# EAGLE schematic synth_revC (EAGLE 6.6.0)

## Sheet 1 of 4
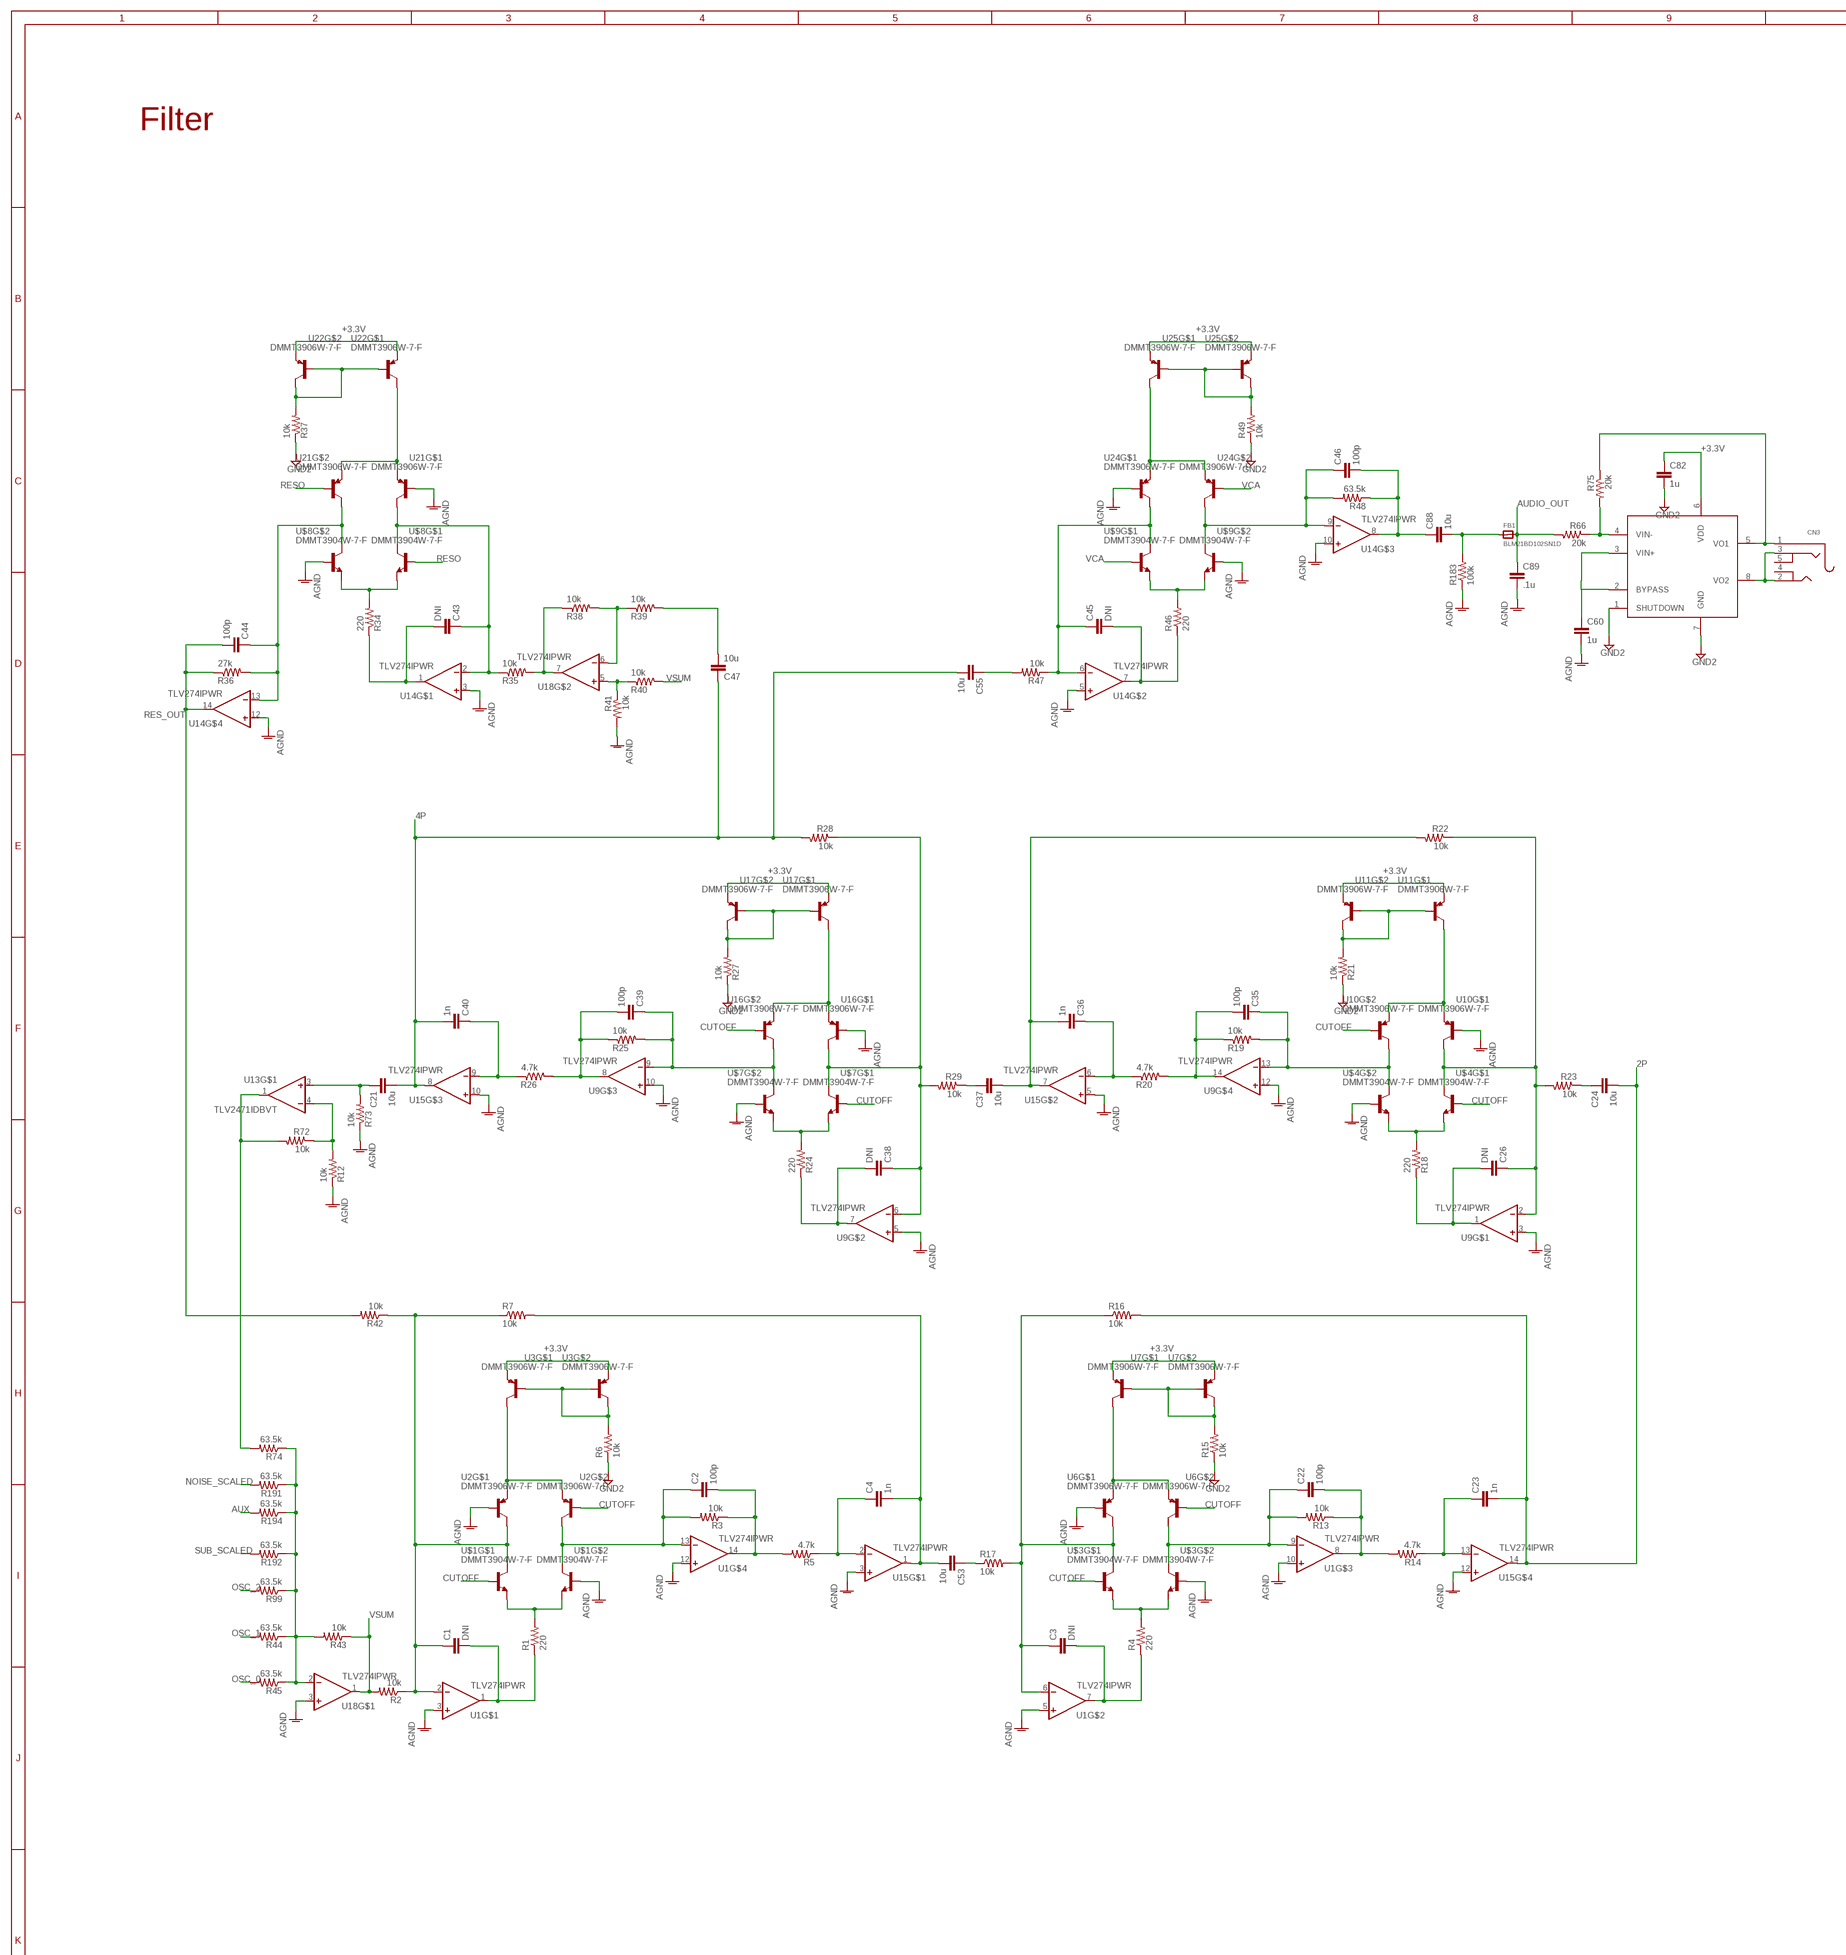
[diagram p0: schematic, sheet 1, part 1 of 3]
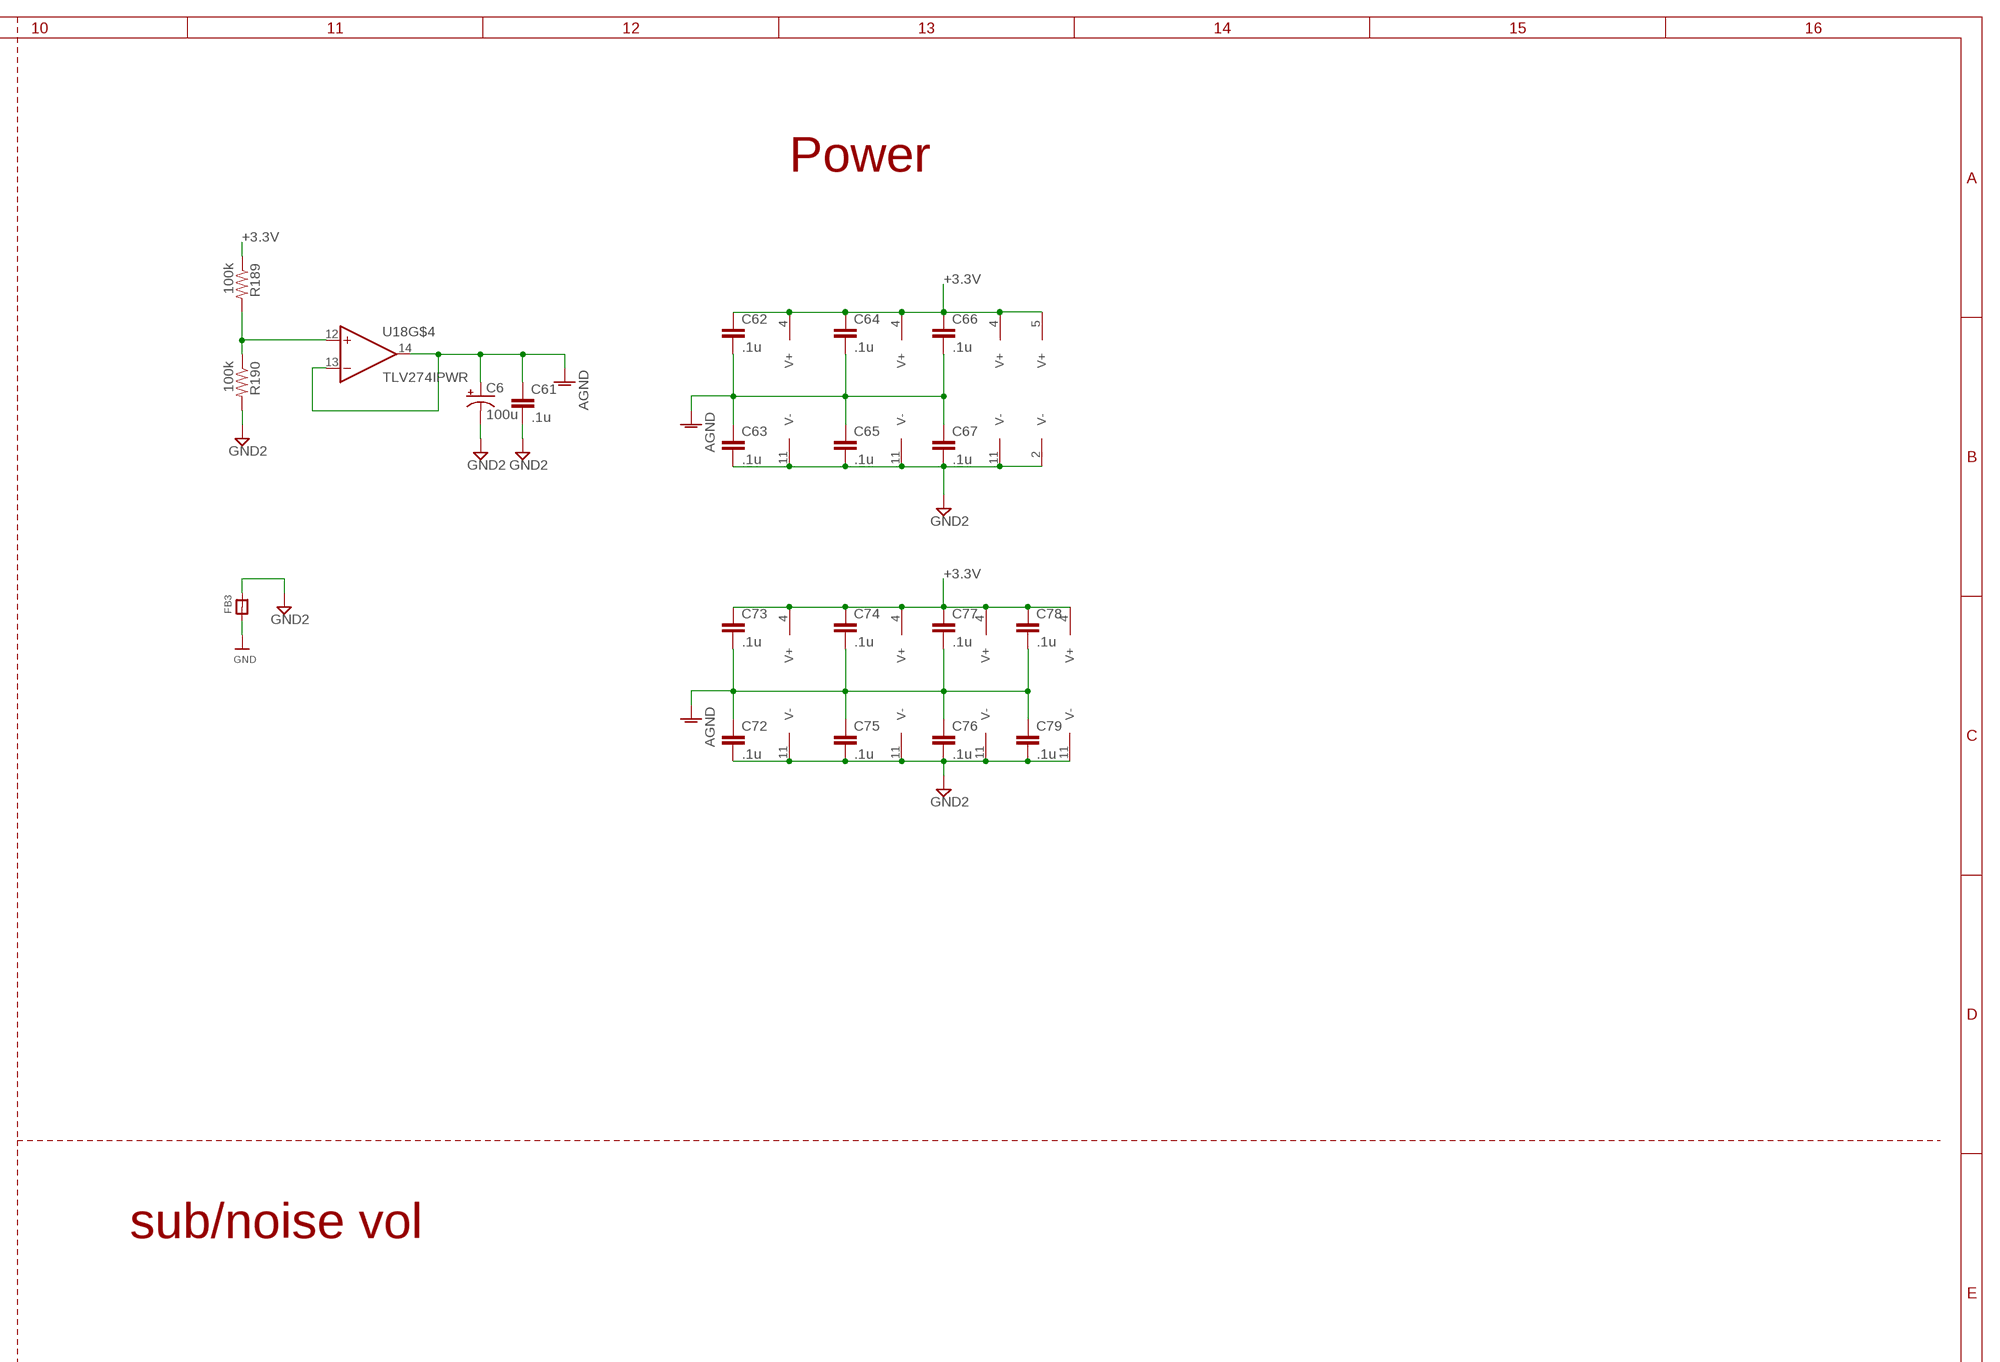
[diagram p1: schematic, sheet 1, part 2 of 3]
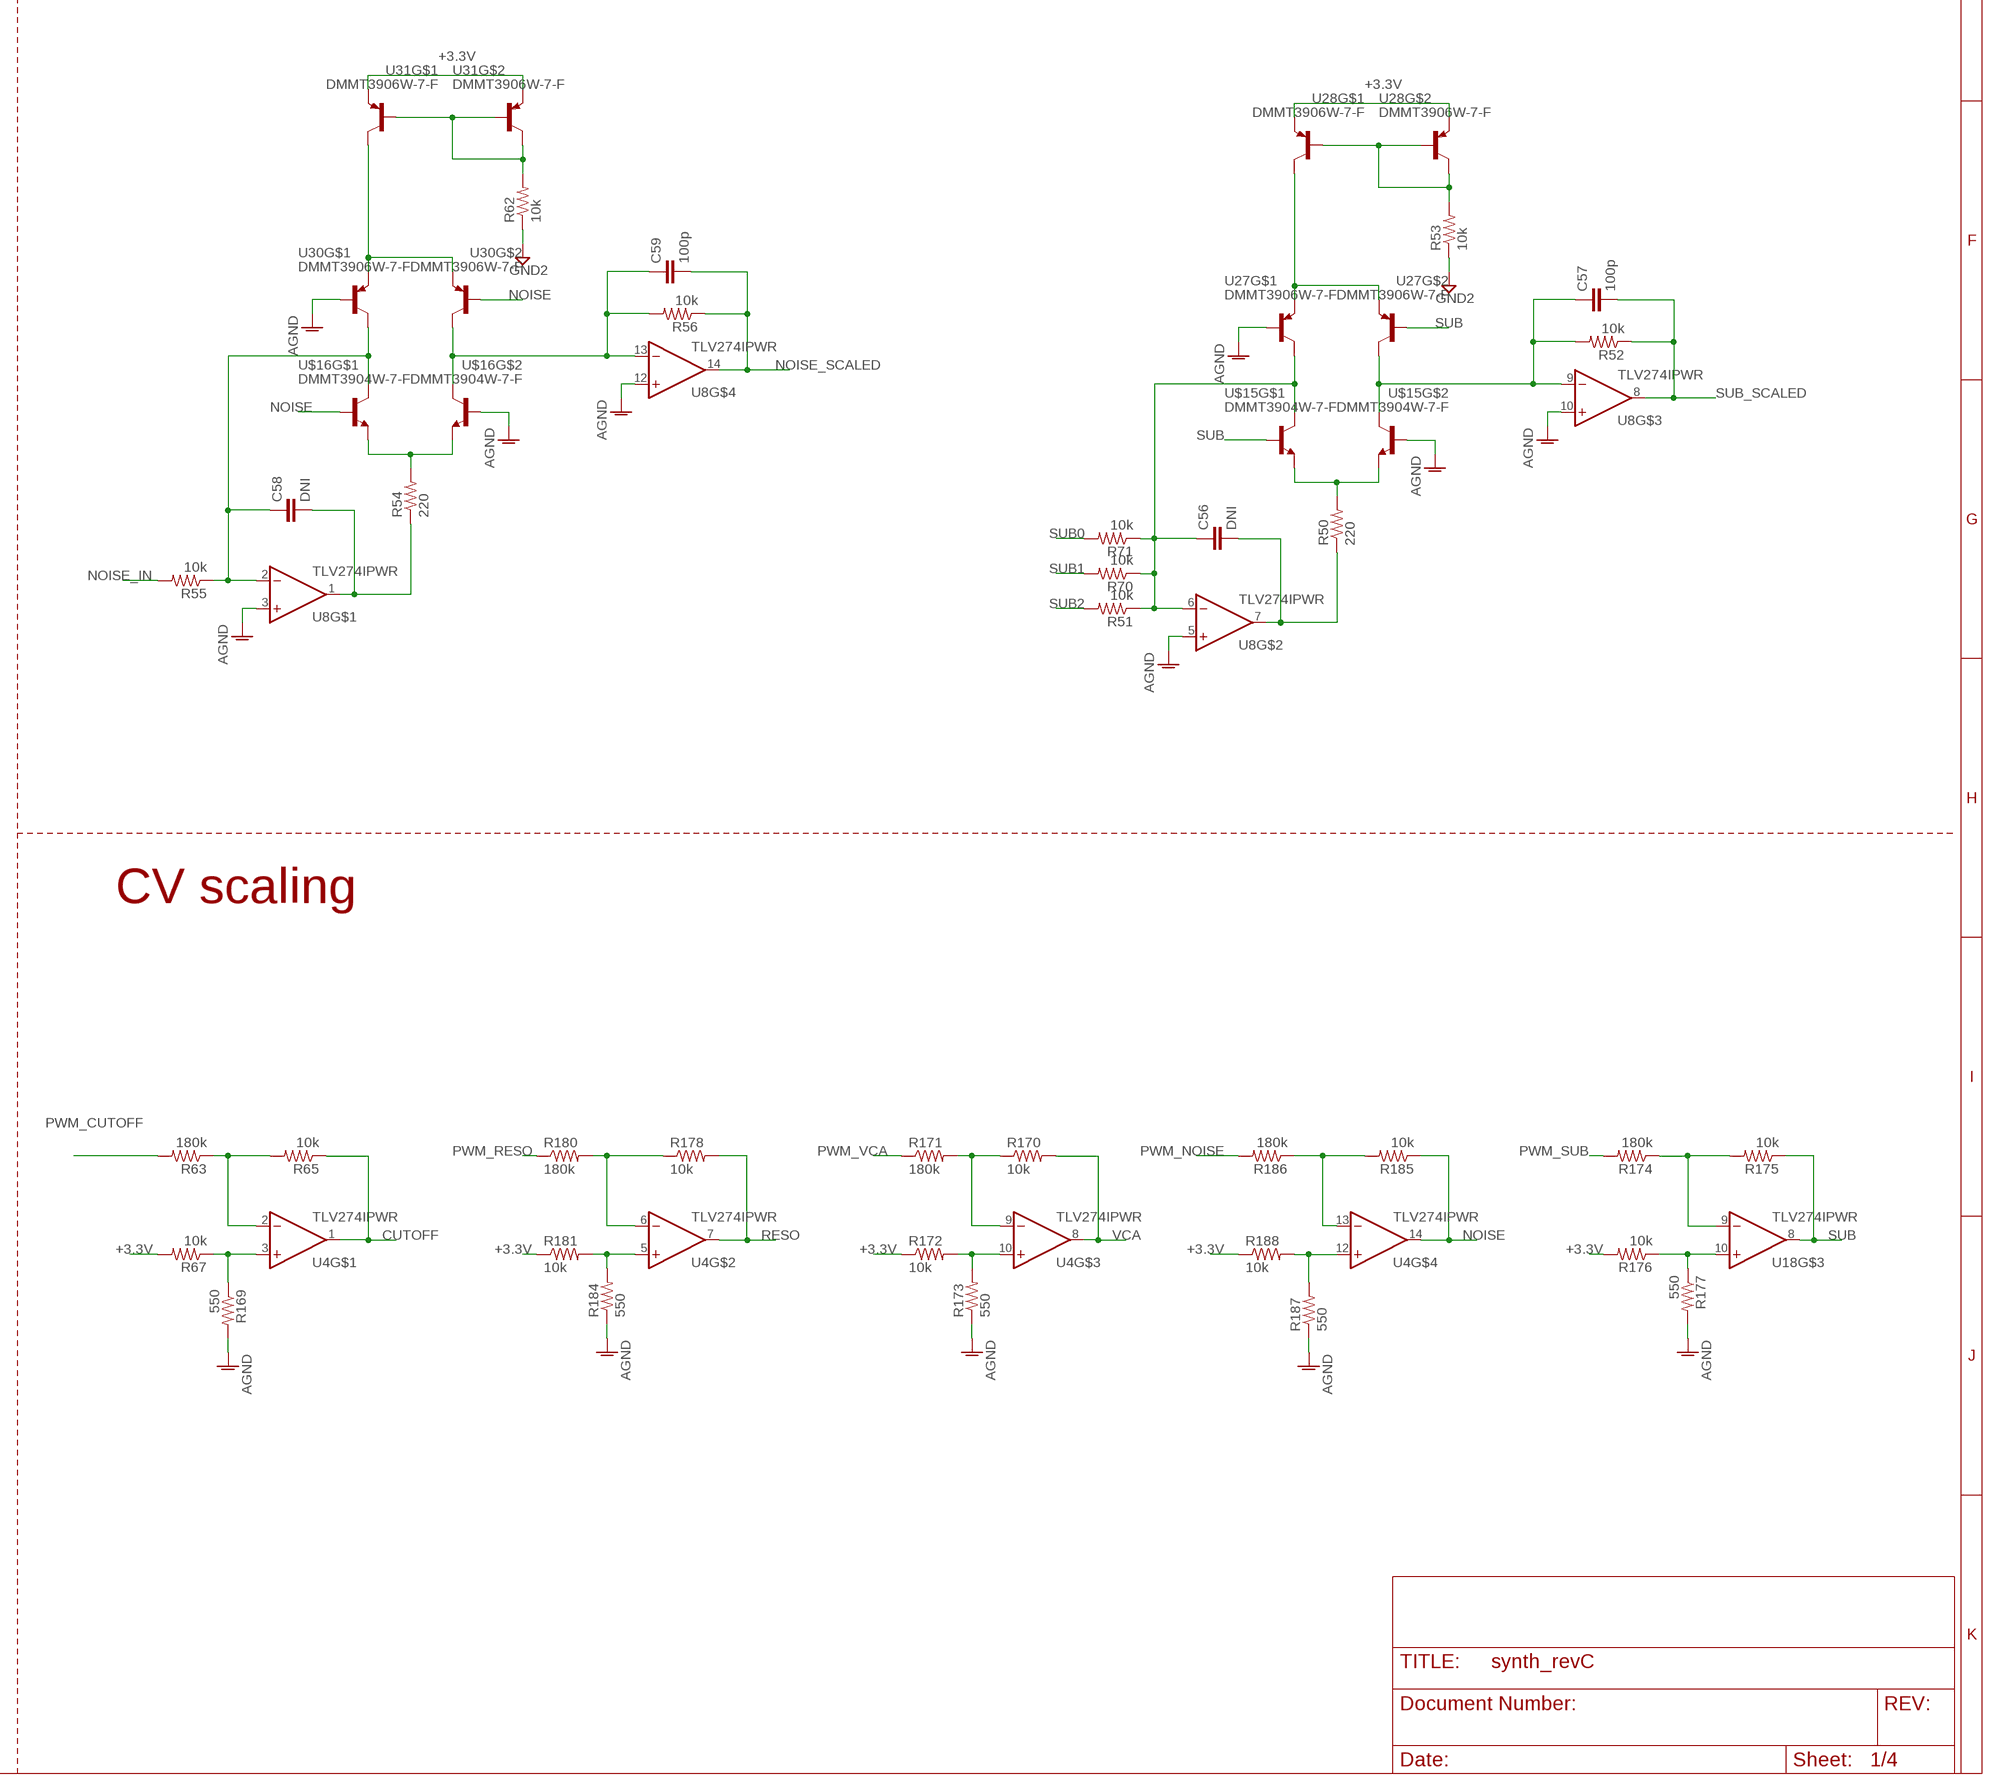
[diagram p2: schematic, sheet 1, part 3 of 3]

### Parts
C1  DNI  C-EUC0603  [C0603]
C2  100p  C-EUC0603  [C0603]
C3  DNI  C-EUC0603  [C0603]
C4  1n  C-EUC0603  [C0603]
C6  100u  CPOL-USC  [PANASONIC_C]
C21  10u  C-EUC0603  [C0603]
C22  100p  C-EUC0603  [C0603]
C23  1n  C-EUC0603  [C0603]
C24  10u  C-EUC0603  [C0603]
C26  DNI  C-EUC0603  [C0603]
C35  100p  C-EUC0603  [C0603]
C36  1n  C-EUC0603  [C0603]
C37  10u  C-EUC0603  [C0603]
C38  DNI  C-EUC0603  [C0603]
C39  100p  C-EUC0603  [C0603]
C40  1n  C-EUC0603  [C0603]
C43  DNI  C-EUC0603  [C0603]
C44  100p  C-EUC0603  [C0603]
C45  DNI  C-EUC0603  [C0603]
C46  100p  C-EUC0603  [C0603]
C47  10u  C-EUC0603  [C0603]
C53  10u  C-EUC0603  [C0603]
C55  10u  C-EUC0603  [C0603]
C56  DNI  C-EUC0603  [C0603]
C57  100p  C-EUC0603  [C0603]
C58  DNI  C-EUC0603  [C0603]
C59  100p  C-EUC0603  [C0603]
C60  1u  C-EUC0603  [C0603]
C61  .1u  C-EUC0603  [C0603]
C62  .1u  C-EUC0603  [C0603]
C63  .1u  C-EUC0603  [C0603]
C64  .1u  C-EUC0603  [C0603]
C65  .1u  C-EUC0603  [C0603]
C66  .1u  C-EUC0603  [C0603]
C67  .1u  C-EUC0603  [C0603]
C72  .1u  C-EUC0603  [C0603]
C73  .1u  C-EUC0603  [C0603]
C74  .1u  C-EUC0603  [C0603]
C75  .1u  C-EUC0603  [C0603]
C76  .1u  C-EUC0603  [C0603]
C77  .1u  C-EUC0603  [C0603]
C78  .1u  C-EUC0603  [C0603]
C79  .1u  C-EUC0603  [C0603]
C82  1u  C-EUC0603  [C0603]
C88  10u  C-EUC0603  [C0603]
C89  .1u  C-EUC0603  [C0603]
CN3  AUDIO_3.5MMJACK  [4UCONN_19269]
FB1  BLM21BD102SN1D  FERRITE0805  [0805]
FB3  FERRITE0805  [0805]
R1  220  R-US_R0603  [R0603]
R2  10k  R-US_R0603  [R0603]
R3  10k  R-US_R0603  [R0603]
R4  220  R-US_R0603  [R0603]
R5  4.7k  R-US_R0603  [R0603]
R6  10k  R-US_R0603  [R0603]
R7  10k  R-US_R0603  [R0603]
R12  10k  R-US_R0603  [R0603]
R13  10k  R-US_R0603  [R0603]
R14  4.7k  R-US_R0603  [R0603]
R15  10k  R-US_R0603  [R0603]
R16  10k  R-US_R0603  [R0603]
R17  10k  R-US_R0603  [R0603]
R18  220  R-US_R0603  [R0603]
R19  10k  R-US_R0603  [R0603]
R20  4.7k  R-US_R0603  [R0603]
R21  10k  R-US_R0603  [R0603]
R22  10k  R-US_R0603  [R0603]
R23  10k  R-US_R0603  [R0603]
R24  220  R-US_R0603  [R0603]
R25  10k  R-US_R0603  [R0603]
R26  4.7k  R-US_R0603  [R0603]
R27  10k  R-US_R0603  [R0603]
R28  10k  R-US_R0603  [R0603]
R29  10k  R-US_R0603  [R0603]
R34  220  R-US_R0603  [R0603]
R35  10k  R-US_R0603  [R0603]
R36  27k  R-US_R0603  [R0603]
R37  10k  R-US_R0603  [R0603]
R38  10k  R-US_R0603  [R0603]
R39  10k  R-US_R0603  [R0603]
R40  10k  R-US_R0603  [R0603]
R41  10k  R-US_R0603  [R0603]
R42  10k  R-US_R0603  [R0603]
R43  10k  R-US_R0603  [R0603]
R44  63.5k  R-US_R0603  [R0603]
R45  63.5k  R-US_R0603  [R0603]
R46  220  R-US_R0603  [R0603]
R47  10k  R-US_R0603  [R0603]
R48  63.5k  R-US_R0603  [R0603]
R49  10k  R-US_R0603  [R0603]
R50  220  R-US_R0603  [R0603]
R51  10k  R-US_R0603  [R0603]
R52  10k  R-US_R0603  [R0603]
R53  10k  R-US_R0603  [R0603]
R54  220  R-US_R0603  [R0603]
R55  10k  R-US_R0603  [R0603]
R56  10k  R-US_R0603  [R0603]
R62  10k  R-US_R0603  [R0603]
R63  180k  R-US_R0603  [R0603]
R65  10k  R-US_R0603  [R0603]
R66  20k  R-US_R0603  [R0603]
R67  10k  R-US_R0603  [R0603]
R70  10k  R-US_R0603  [R0603]
R71  10k  R-US_R0603  [R0603]
R72  10k  R-US_R0603  [R0603]
R73  10k  R-US_R0603  [R0603]
R74  63.5k  R-US_R0603  [R0603]
R75  20k  R-US_R0603  [R0603]
R99  63.5k  R-US_R0603  [R0603]
R169  550  R-US_R0603  [R0603]
R170  10k  R-US_R0603  [R0603]
R171  180k  R-US_R0603  [R0603]
R172  10k  R-US_R0603  [R0603]
R173  550  R-US_R0603  [R0603]
R174  180k  R-US_R0603  [R0603]
R175  10k  R-US_R0603  [R0603]
R176  10k  R-US_R0603  [R0603]
R177  550  R-US_R0603  [R0603]
R178  10k  R-US_R0603  [R0603]
R180  180k  R-US_R0603  [R0603]
R181  10k  R-US_R0603  [R0603]
R183  100k  R-US_R0402  [R0402]
R184  550  R-US_R0603  [R0603]
R185  10k  R-US_R0603  [R0603]
R186  180k  R-US_R0603  [R0603]
R187  550  R-US_R0603  [R0603]
R188  10k  R-US_R0603  [R0603]
R189  100k  R-US_R0603  [R0603]
R190  100k  R-US_R0603  [R0603]
R191  63.5k  R-US_R0603  [R0603]
R192  63.5k  R-US_R0603  [R0603]
R194  63.5k  R-US_R0603  [R0603]
U1  TLV274IPWR  [SOP65P640X120-14N]
U2  DMMT3906W-7-F  [SOT65P210X110-6N]
U3  DMMT3906W-7-F  [SOT65P210X110-6N]
U4  TLV274IPWR  [SOP65P640X120-14N]
U6  DMMT3906W-7-F  [SOT65P210X110-6N]
U7  DMMT3906W-7-F  [SOT65P210X110-6N]
U8  TLV274IPWR  [SOP65P640X120-14N]
U9  TLV274IPWR  [SOP65P640X120-14N]
U10  DMMT3906W-7-F  [SOT65P210X110-6N]
U11  DMMT3906W-7-F  [SOT65P210X110-6N]
U13  TLV2471IDBVT  [SOT95P280X145-5N]
U14  TLV274IPWR  [SOP65P640X120-14N]
U15  TLV274IPWR  [SOP65P640X120-14N]
U16  DMMT3906W-7-F  [SOT65P210X110-6N]
U17  DMMT3906W-7-F  [SOT65P210X110-6N]
U18  TLV274IPWR  [SOP65P640X120-14N]
U21  DMMT3906W-7-F  [SOT65P210X110-6N]
U22  DMMT3906W-7-F  [SOT65P210X110-6N]
U24  DMMT3906W-7-F  [SOT65P210X110-6N]
U25  DMMT3906W-7-F  [SOT65P210X110-6N]
U27  DMMT3906W-7-F  [SOT65P210X110-6N]
U28  DMMT3906W-7-F  [SOT65P210X110-6N]
U30  DMMT3906W-7-F  [SOT65P210X110-6N]
U31  DMMT3906W-7-F  [SOT65P210X110-6N]
U$1  DMMT3904W-7-F  [SOT65P210X100-6N]
U$3  DMMT3904W-7-F  [SOT65P210X100-6N]
U$4  DMMT3904W-7-F  [SOT65P210X100-6N]
U$7  DMMT3904W-7-F  [SOT65P210X100-6N]
U$8  DMMT3904W-7-F  [SOT65P210X100-6N]
U$9  DMMT3904W-7-F  [SOT65P210X100-6N]
U$15  DMMT3904W-7-F  [SOT65P210X100-6N]
U$16  DMMT3904W-7-F  [SOT65P210X100-6N]
U$19  LM4819MMX  [SOP65P490X110-8N]

### Nets
2P: C23.2 C24.2 R16.2 U15.14(OUT) ; also sheet 3
4P: C21.2 C40.2 C47.1 C55.2 R28.2 U15.8(OUT) ; also sheet 3
$P6543: C46.2 C88.1 R48.1 U14.8(OUT)
+3.3V: C62.1 C64.1 C66.1 C73.1 C74.1 C77.1 C78.1 C82.1 R67.2 R172.1 R176.2 R181.1 R188.1 R189.1 U1.4(V+) U3.4(E) U3.5(E) U4.4(V+) U7.4(E) U7.5(E) U8.4(V+) U9.4(V+) U11.4(E) U11.5(E) U13.5(V+) U14.4(V+) U15.4(V+) U17.4(E) U17.5(E) U18.4(V+) U22.4(E) U22.5(E) U25.4(E) U25.5(E) U28.4(E) U28.5(E) U31.4(E) U31.5(E) U$19.6(VDD) ; also sheet 2,3,4
AGND: C6.+ C60.2 C61.1 C62.2 C63.1 C64.2 C65.1 C66.2 C67.1 C72.1 C73.2 C74.2 C75.1 C76.1 C77.2 C78.2 C79.1 C89.2 R12.1 R41.2 R73.1 R169.2 R173.1 R177.2 R183.1 R184.1 R187.1 U1.3(+IN) U1.5(+IN) U1.10(+IN) U1.12(+IN) U2.2(B) U6.2(B) U8.3(+IN) U8.5(+IN) U8.10(+IN) U8.12(+IN) U9.3(+IN) U9.5(+IN) U9.10(+IN) U9.12(+IN) U10.2(B) U14.3(+IN) U14.5(+IN) U14.10(+IN) U14.12(+IN) U15.3(+IN) U15.5(+IN) U15.10(+IN) U15.12(+IN) U16.2(B) U18.3(+IN) U18.13(-IN) U18.14(OUT) U21.2(B) U24.2(B) U27.2(B) U30.2(B) U$1.1(B) U$3.1(B) U$4.1(B) U$7.1(B) U$8.1(B) U$9.1(B) U$15.1(B) U$16.1(B) ; also sheet 3
AUDIO_OUT: C89.1 FB1.2 R66.2 ; also sheet 3
AUDIO_OUT1: C60.1 U$19.2(BYPASS) U$19.3(VIN+)
AUX: R194.2 ; also sheet 3
CUTOFF: R65.1 U2.1(B) U4.1(OUT) U6.1(B) U10.1(B) U16.1(B) U$1.2(B) U$3.2(B) U$4.2(B) U$7.2(B)
GND: FB3.1 ; also sheet 2,3,4
GND2: C6.- C61.2 C63.2 C65.2 C67.2 C72.2 C75.2 C76.2 C79.2 C82.2 FB3.2 R6.1 R15.1 R21.1 R27.1 R37.1 R49.1 R53.1 R62.1 R190.2 U1.11(V-) U4.11(V-) U8.11(V-) U9.11(V-) U13.2(V-) U14.11(V-) U15.11(V-) U18.11(V-) U$19.1(SHUTDOWN) U$19.7(GND) ; also sheet 3
N$2: C1.1 R2.1 R7.1 R42.1 U1.2(-IN) U2.3(C) U$1.3(C)
N$3: C2.1 R3.2 U1.13(-IN) U2.6(C) U$1.6(C)
N$5: R1.2 U$1.4(E) U$1.5(E)
N$6: C1.2 R1.1 U1.1(OUT)
N$9: R6.2 U3.1(B) U3.2(B) U3.6(C)
N$13: U2.4(E) U2.5(E) U3.3(C)
N$18: C2.2 R3.1 R5.2 U1.14(OUT)
N$19: C3.1 R16.1 R17.2 U1.6(-IN) U6.3(C) U$3.3(C)
N$21: C22.1 R13.2 U1.9(-IN) U6.6(C) U$3.6(C)
N$22: R4.2 U$3.4(E) U$3.5(E)
N$23: C4.1 R5.1 U15.2(-IN)
N$24: C3.2 R4.1 U1.7(OUT)
N$25: C4.2 C53.2 R7.2 U15.1(OUT)
N$26: C21.1 R73.2 U13.3(+IN)
N$33: R12.2 R72.1 U13.4(-IN)
N$34: R72.2 R74.2 U13.1(OUT)
N$42: CN3.2 CN3.3 U$19.8(VO2)
N$44: R66.1 R75.2 U$19.4(VIN-)
N$46: CN3.1 R75.1 U$19.5(VO1)
N$49: R15.2 U7.1(B) U7.2(B) U7.6(C)
N$50: U6.4(E) U6.5(E) U7.3(C)
N$51: C22.2 R13.1 R14.2 U1.8(OUT)
N$52: C23.1 R14.1 U15.13(-IN)
N$54: C53.1 R17.1
N$57: C26.1 R22.1 R23.2 U9.2(-IN) U10.3(C) U$4.3(C)
N$58: C35.1 R19.2 U9.13(-IN) U10.6(C) U$4.6(C)
N$59: R18.2 U$4.4(E) U$4.5(E)
N$60: C26.2 R18.1 U9.1(OUT)
N$61: R21.2 U11.1(B) U11.2(B) U11.6(C)
N$62: U10.4(E) U10.5(E) U11.3(C)
N$63: C35.2 R19.1 R20.2 U9.14(OUT)
N$64: C36.1 R20.1 U15.6(-IN)
N$65: C36.2 C37.2 R22.2 U15.7(OUT)
N$66: C24.1 R23.1
N$67: C38.1 R28.1 R29.2 U9.6(-IN) U16.3(C) U$7.3(C)
N$69: C39.1 R25.2 U9.9(-IN) U16.6(C) U$7.6(C)
N$70: R24.2 U$7.4(E) U$7.5(E)
N$71: C38.2 R24.1 U9.7(OUT)
N$72: R27.2 U17.1(B) U17.2(B) U17.6(C)
N$74: U16.4(E) U16.5(E) U17.3(C)
N$75: C39.2 R25.1 R26.2 U9.8(OUT)
N$76: C40.1 R26.1 U15.9(-IN)
N$78: C37.1 R29.1
N$136: C56.1 R51.1 R70.1 R71.1 U8.6(-IN) U27.3(C) U$15.3(C)
N$137: C43.1 R35.1 U14.2(-IN) U21.3(C) U$8.3(C)
N$138: R67.1 R169.1 U4.3(+IN)
N$139: R34.2 U$8.4(E) U$8.5(E)
N$140: C43.2 R34.1 U14.1(OUT)
N$141: R37.2 U22.1(B) U22.2(B) U22.6(C)
N$143: U21.4(E) U21.5(E) U22.3(C)
N$144: C45.1 R47.1 U14.6(-IN) U24.3(C) U$9.3(C)
N$145: R40.1 R41.1 U18.5(+IN)
N$146: R35.2 R38.1 U18.7(OUT)
N$147: R38.2 R39.1 U18.6(-IN)
N$148: C46.1 R48.2 U14.9(-IN) U24.6(C) U$9.6(C)
N$149: C47.2 R39.2
N$150: R46.2 U$9.4(E) U$9.5(E)
N$153: R43.2 R44.1 R45.1 R74.1 R99.1 R191.1 R192.1 R194.1 U18.2(-IN)
N$154: C45.2 R46.1 U14.7(OUT)
N$159: C88.2 FB1.1 R183.2
N$161: R49.2 U25.1(B) U25.2(B) U25.6(C)
N$163: U24.4(E) U24.5(E) U25.3(C)
N$164: C55.1 R47.2
N$167: C57.1 R52.2 U8.9(-IN) U27.6(C) U$15.6(C)
N$168: R50.2 U$15.4(E) U$15.5(E)
N$169: C56.2 R50.1 U8.7(OUT)
N$170: R53.2 U28.1(B) U28.2(B) U28.6(C)
N$172: U27.4(E) U27.5(E) U28.3(C)
N$173: C58.1 R55.1 U8.2(-IN) U30.3(C) U$16.3(C)
N$174: C59.1 R56.2 U8.13(-IN) U30.6(C) U$16.6(C)
N$175: R54.2 U$16.4(E) U$16.5(E)
N$176: C58.2 R54.1 U8.1(OUT)
N$177: R62.2 U31.1(B) U31.2(B) U31.6(C)
N$179: U30.4(E) U30.5(E) U31.3(C)
N$180: C44.1 R36.2 U14.13(-IN) U21.6(C) U$8.6(C)
N$181: R63.1 R65.2 U4.2(-IN)
N$182: R176.1 R177.1 U18.10(+IN)
N$183: R170.1 R171.2 U4.9(-IN)
N$184: R174.1 R175.2 U18.9(-IN)
N$185: R172.2 R173.2 U4.10(+IN)
N$187: R185.2 R186.1 U4.13(-IN)
N$189: R187.2 R188.2 U4.12(+IN)
N$191: R181.2 R184.2 U4.5(+IN)
N$192: R178.1 R180.2 U4.6(-IN)
N$194: R189.2 R190.1 U18.12(+IN)
NOISE: R185.1 U4.14(OUT) U30.1(B) U$16.2(B)
NOISE_IN: R55.2 ; also sheet 2
NOISE_SCALED: C59.2 R56.1 R191.2 U8.14(OUT)
OSC_0: R45.2 ; also sheet 2,3
OSC_1: R44.2 ; also sheet 2,3
OSC_2: R99.2 ; also sheet 2,3
PWM_CUTOFF: R63.2 ; also sheet 2,3
PWM_NOISE: R186.2 ; also sheet 2
PWM_RESO: R180.1 ; also sheet 2
PWM_SUB: R174.2 ; also sheet 2
PWM_VCA: R171.1 ; also sheet 2
RES_OUT: C44.2 R36.1 R42.2 U14.14(OUT)
RESO: R178.2 U4.7(OUT) U21.1(B) U$8.2(B)
SUB: R175.1 U18.8(OUT) U27.1(B) U$15.2(B)
SUB0: R71.2 ; also sheet 2
SUB1: R70.2 ; also sheet 2
SUB2: R51.2 ; also sheet 2
SUB_SCALED: C57.2 R52.1 R192.2 U8.8(OUT)
VCA: R170.2 U4.8(OUT) U24.1(B) U$9.2(B)
VSUM: R2.2 R40.2 R43.1 U18.1(OUT)
Unconnected: CN3.4 CN3.5

### Notes on the sheet
- Power
- Filter
- sub/noise vol
- CV scaling

## Sheet 2 of 4
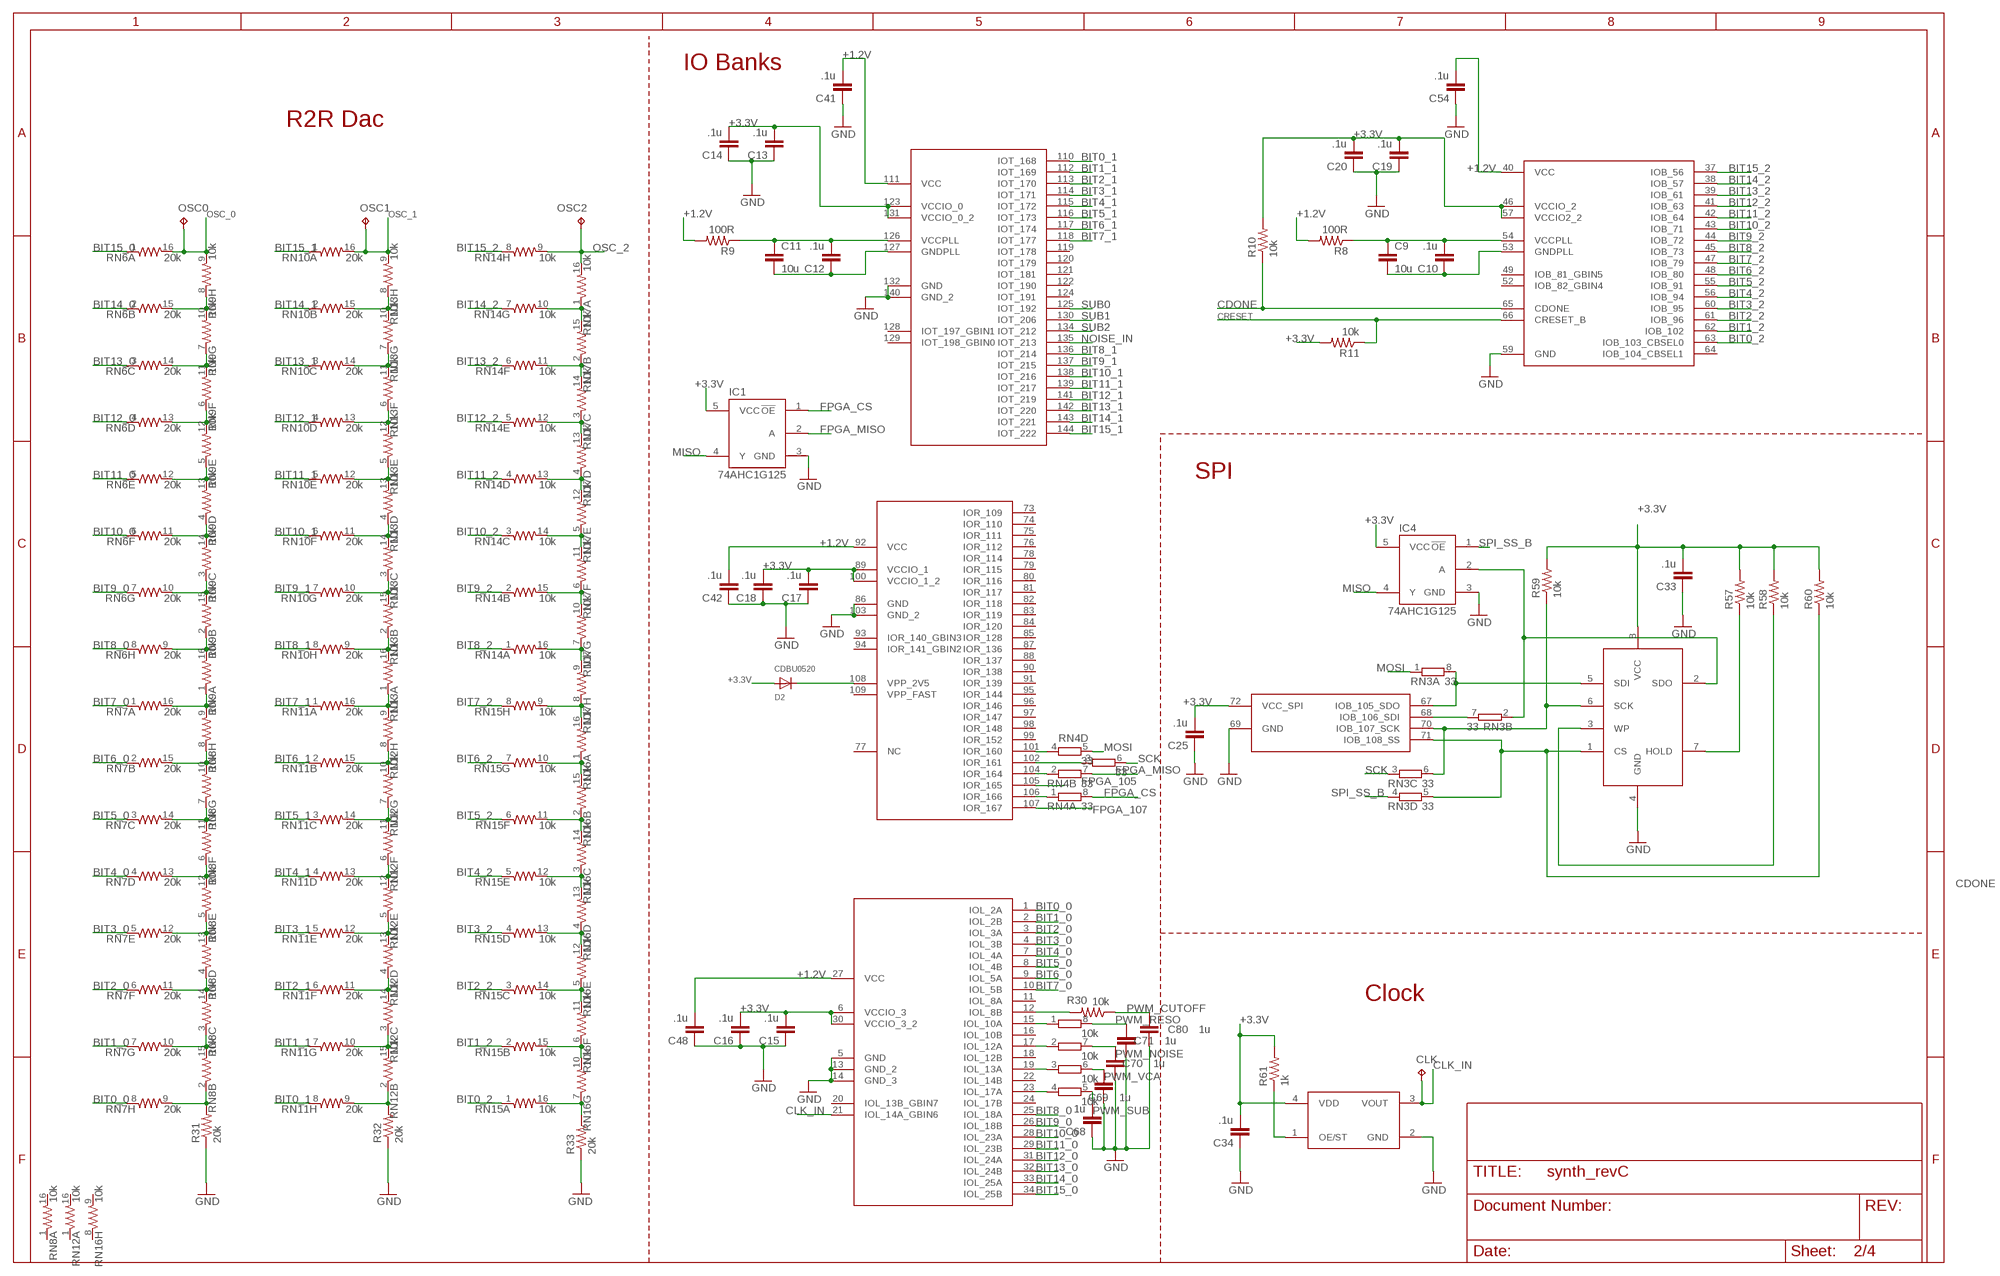
[diagram p3: schematic, sheet 2]

### Parts
C9  10u  C-EUC0603  [C0603]
C10  .1u  C-EUC0603  [C0603]
C11  10u  C-EUC0603  [C0603]
C12  .1u  C-EUC0603  [C0603]
C13  .1u  C-EUC0603  [C0603]
C14  .1u  C-EUC0603  [C0603]
C15  .1u  C-EUC0603  [C0603]
C16  .1u  C-EUC0603  [C0603]
C17  .1u  C-EUC0603  [C0603]
C18  .1u  C-EUC0603  [C0603]
C19  .1u  C-EUC0603  [C0603]
C20  .1u  C-EUC0603  [C0603]
C25  .1u  C-EUC0603  [C0603]
C33  .1u  C-EUC0603  [C0603]
C34  .1u  C-EUC0603  [C0603]
C41  .1u  C-EUC0603  [C0603]
C42  .1u  C-EUC0603  [C0603]
C48  .1u  C-EUC0603  [C0603]
C54  .1u  C-EUC0603  [C0603]
C68  1u  C-EUC0603  [C0603]
C69  1u  C-EUC0603  [C0603]
C70  1u  C-EUC0603  [C0603]
C71  1u  C-EUC0603  [C0603]
C80  1u  C-EUC0603  [C0603]
CLK  TPB1,27  [B1,27]
D2  CDBU0520  DIODESOD-523  [SOD-523]
IC1  74AHC1G125  [SOT23-5L]
IC4  74AHC1G125  [SOT23-5L]
OSC0  TPB1,27  [B1,27]
OSC1  TPB1,27  [B1,27]
OSC2  TPB1,27  [B1,27]
R8  100R  R-US_R0603  [R0603]
R9  100R  R-US_R0603  [R0603]
R10  10k  R-US_R0603  [R0603]
R11  10k  R-US_R0603  [R0603]
R30  10k  R-US_R0603  [R0603]
R31  20k  R-US_R0603  [R0603]
R32  20k  R-US_R0603  [R0603]
R33  20k  R-US_R0603  [R0603]
R57  10k  R-US_R0603  [R0603]
R58  10k  R-US_R0603  [R0603]
R59  10k  R-US_R0603  [R0603]
R60  10k  R-US_R0603  [R0603]
R61  1k  R-US_R0603  [R0603]
RAM1  N25Q032A13ESC40FTR  [SO08]
RN3  33  4R-N0603-ARC  [0603-ARC]
RN4  33  4R-N0603-ARC  [0603-ARC]
RN5  10k  4R-N0603-ARC  [0603-ARC]
RN6  20k  742-16_S  [742-16]
RN7  20k  742-16_S  [742-16]
RN8  10k  742-16_S  [742-16]
RN9  10k  742-16_S  [742-16]
RN10  20k  742-16_S  [742-16]
RN11  20k  742-16_S  [742-16]
RN12  10k  742-16_S  [742-16]
RN13  10k  742-16_S  [742-16]
RN14  10k  742-16_S  [742-16]
RN15  10k  742-16_S  [742-16]
RN16  10k  742-16_S  [742-16]
RN17  10k  742-16_S  [742-16]
U$2  ICE40HX4K  [TQ144]
U$5  SIT1602  [SMD-43.2X2.5]

### Nets
$P534: R59.1 RAM1.6(SCK) RN3.6 U$2.70(IOB_107_SCK)
$P789: R60.1 RAM1.1(CS) RN3.5 U$2.71(IOB_108_SS)
$P3423: RAM1.5(SDI) RN3.8 U$2.67(IOB_105_SDO)
+1.2V: C41.2 C42.2 C48.2 C54.2 R8.2 R9.2 U$2.27(VCC) U$2.40(VCC) U$2.92(VCC) U$2.111(VCC) ; also sheet 4
+3.3V: C13.2 C14.2 C15.2 C16.2 C17.2 C18.2 C19.2 C20.2 C25.2 C33.2 C34.2 D2.A IC1.5(VCC) IC4.5(VCC) R10.2 R11.2 R57.2 R58.2 R59.2 R60.2 R61.2 RAM1.8(VCC) U$2.6(VCCIO_3) U$2.30(VCCIO_3_2) U$2.46(VCCIO_2) U$2.57(VCCIO2_2) U$2.72(VCC_SPI) U$2.89(VCCIO_1) U$2.100(VCCIO_1_2) U$2.123(VCCIO_0) U$2.131(VCCIO_0_2) U$5.4(VDD) ; also sheet 1,3,4
BIT0_0: RN7.8 U$2.1(IOL_2A)
BIT0_1: RN11.8 U$2.110(IOT_168)
BIT0_2: RN15.1 U$2.63(IOB_103_CBSEL0)
BIT1_0: RN7.7 U$2.2(IOL_2B)
BIT1_1: RN11.7 U$2.112(IOT_169)
BIT1_2: RN15.2 U$2.62(IOB_102)
BIT2_0: RN7.6 U$2.3(IOL_3A)
BIT2_1: RN11.6 U$2.113(IOT_170)
BIT2_2: RN15.3 U$2.61(IOB_96)
BIT3_0: RN7.5 U$2.4(IOL_3B)
BIT3_1: RN11.5 U$2.114(IOT_171)
BIT3_2: RN15.4 U$2.60(IOB_95)
BIT4_0: RN7.4 U$2.7(IOL_4A)
BIT4_1: RN11.4 U$2.115(IOT_172)
BIT4_2: RN15.5 U$2.56(IOB_94)
BIT5_0: RN7.3 U$2.8(IOL_4B)
BIT5_1: RN11.3 U$2.116(IOT_173)
BIT5_2: RN15.6 U$2.55(IOB_91)
BIT6_0: RN7.2 U$2.9(IOL_5A)
BIT6_1: RN11.2 U$2.117(IOT_174)
BIT6_2: RN15.7 U$2.48(IOB_80)
BIT7_0: RN7.1 U$2.10(IOL_5B)
BIT7_1: RN11.1 U$2.118(IOT_177)
BIT7_2: RN15.8 U$2.47(IOB_79)
BIT8_0: RN6.8 U$2.25(IOL_18A)
BIT8_1: RN10.8 U$2.136(IOT_214)
BIT8_2: RN14.1 U$2.45(IOB_73)
BIT9_0: RN6.7 U$2.26(IOL_18B)
BIT9_1: RN10.7 U$2.137(IOT_215)
BIT9_2: RN14.2 U$2.44(IOB_72)
BIT10_0: RN6.6 U$2.28(IOL_23A)
BIT10_1: RN10.6 U$2.138(IOT_216)
BIT10_2: RN14.3 U$2.43(IOB_71)
BIT11_0: RN6.5 U$2.29(IOL_23B)
BIT11_1: RN10.5 U$2.139(IOT_217)
BIT11_2: RN14.4 U$2.42(IOB_64)
BIT12_0: RN6.4 U$2.31(IOL_24A)
BIT12_1: RN10.4 U$2.141(IOT_219)
BIT12_2: RN14.5 U$2.41(IOB_63)
BIT13_0: RN6.3 U$2.32(IOL_24B)
BIT13_1: RN10.3 U$2.142(IOT_220)
BIT13_2: RN14.6 U$2.39(IOB_61)
BIT14_0: RN6.2 U$2.33(IOL_25A)
BIT14_1: RN10.2 U$2.143(IOT_221)
BIT14_2: RN14.7 U$2.38(IOB_57)
BIT15_0: RN6.1 U$2.34(IOL_25B)
BIT15_1: RN10.1 U$2.144(IOT_222)
BIT15_2: RN14.8 U$2.37(IOB_56)
CDONE: R10.1 U$2.65(CDONE) ; also sheet 3
CLK_IN: CLK.TP U$2.21(IOL_14A_GBIN6) U$5.3(VOUT)
CRESET: R11.1 U$2.66(CRESET_B) ; also sheet 3
FPGA_105: U$2.105(IOR_165) ; also sheet 3
FPGA_107: U$2.107(IOR_167) ; also sheet 3
FPGA_CS: IC1.1(!OE) RN4.8 ; also sheet 3
FPGA_MISO: IC1.2(A) RN4.7
GND: C13.1 C14.1 C15.1 C16.1 C17.1 C18.1 C19.1 C20.1 C25.1 C33.1 C34.1 C41.1 C42.1 C48.1 C54.1 C68.1 C69.1 C70.1 C71.1 C80.1 IC1.3(GND) IC4.3(GND) R31.1 R32.1 R33.1 RAM1.4(GND) U$2.5(GND) U$2.13(GND_2) U$2.14(GND_3) U$2.59(GND) U$2.69(GND) U$2.86(GND) U$2.103(GND_2) U$2.132(GND) U$2.140(GND_2) U$5.2(GND) ; also sheet 1,3,4
MISO: IC1.4(Y) IC4.4(Y) ; also sheet 3
MOSI: RN3.1 RN4.5 ; also sheet 3
N$7: R57.1 RAM1.7(HOLD)
N$8: R58.1 RAM1.3(WP)
N$10: R33.2 RN15.16 RN16.7
N$11: R61.1 U$5.1(OE/ST)
N$14: RN4.4 U$2.101(IOR_160)
N$28: RN14.10 RN17.1 RN17.15
N$29: C9.1 C10.2 R8.1 U$2.54(VCCPLL)
N$30: C9.2 C10.1 U$2.53(GNDPLL)
N$31: C11.1 C12.2 R9.1 U$2.126(VCCPLL)
N$32: C11.2 C12.1 U$2.127(GNDPLL)
N$35: D2.K(C) U$2.108(VPP_2V5)
N$37: R32.2 RN11.9 RN12.2
N$38: RN15.15 RN16.6 RN16.10
N$39: RN15.14 RN16.5 RN16.11
N$40: RN15.13 RN16.4 RN16.12
N$41: RN5.4 U$2.23(IOL_17A)
N$48: RN3.7 U$2.68(IOB_106_SDI)
N$55: RN15.12 RN16.3 RN16.13
N$56: RN5.3 U$2.19(IOL_13A)
N$68: RN15.11 RN16.2 RN16.14
N$73: RN15.10 RN16.1 RN16.15
N$77: RN4.3 U$2.102(IOR_161)
N$79: RN15.9 RN16.16 RN17.8
N$80: RN14.16 RN17.7 RN17.9
N$81: RN4.2 U$2.104(IOR_164)
N$82: RN4.1 U$2.106(IOR_166)
N$83: RN14.15 RN17.6 RN17.10
N$84: RN14.14 RN17.5 RN17.11
N$85: RN14.13 RN17.4 RN17.12
N$86: RN14.12 RN17.3 RN17.13
N$87: RN14.11 RN17.2 RN17.14
N$88: RN11.10 RN12.3 RN12.15
N$89: RN10.15 RN13.8 RN13.10
N$90: RN10.14 RN13.7 RN13.11
N$91: RN10.13 RN13.6 RN13.12
N$92: RN10.12 RN13.5 RN13.13
N$93: RN10.11 RN13.4 RN13.14
N$94: RN10.10 RN13.3 RN13.15
N$95: RN10.9 RN13.2 RN13.16
N$96: RN11.16 RN12.9 RN13.1
N$97: RN11.15 RN12.8 RN12.10
N$98: RN11.14 RN12.7 RN12.11
N$99: RN11.13 RN12.6 RN12.12
N$100: RN11.12 RN12.5 RN12.13
N$101: RN11.11 RN12.4 RN12.14
N$102: R31.2 RN7.9 RN8.2
N$103: RN7.10 RN8.3 RN8.15
N$104: RN6.15 RN9.8 RN9.10
N$105: RN6.14 RN9.7 RN9.11
N$106: RN6.13 RN9.6 RN9.12
N$107: RN6.12 RN9.5 RN9.13
N$108: RN6.11 RN9.4 RN9.14
N$109: RN6.10 RN9.3 RN9.15
N$110: RN6.9 RN9.2 RN9.16
N$111: RN7.16 RN8.9 RN9.1
N$112: RN7.15 RN8.8 RN8.10
N$113: RN7.14 RN8.7 RN8.11
N$114: RN7.13 RN8.6 RN8.12
N$115: RN7.12 RN8.5 RN8.13
N$116: RN7.11 RN8.4 RN8.14
N$123: RN5.2 U$2.17(IOL_12A)
N$124: RN5.1 U$2.15(IOL_10A)
N$127: R30.2 U$2.12(IOL_8B)
NOISE_IN: U$2.135(IOT_213) ; also sheet 1
OSC_0: OSC0.TP RN6.16 RN9.9 ; also sheet 1,3
OSC_1: OSC1.TP RN10.16 RN13.9 ; also sheet 1,3
OSC_2: OSC2.TP RN14.9 RN17.16 ; also sheet 1,3
PWM_CUTOFF: C80.2 R30.1 ; also sheet 1,3
PWM_NOISE: C70.2 RN5.7 ; also sheet 1
PWM_RESO: C71.2 RN5.8 ; also sheet 1
PWM_SUB: C68.2 RN5.5 ; also sheet 1
PWM_VCA: C69.2 RN5.6 ; also sheet 1
SCK: RN3.3 RN4.6 ; also sheet 3
SPI_SDI: IC4.2(A) RAM1.2(SDO) RN3.2
SPI_SS_B: IC4.1(!OE) RN3.4 ; also sheet 3
SUB0: U$2.125(IOT_192) ; also sheet 1
SUB1: U$2.130(IOT_206) ; also sheet 1
SUB2: U$2.134(IOT_212) ; also sheet 1
Unconnected: RN8.1 RN8.16 RN12.1 RN12.16 RN16.8 RN16.9 U$2.11(IOL_8A) U$2.16(IOL_10B) U$2.18(IOL_12B) U$2.20(IOL_13B_GBIN7) U$2.22(IOL_14B) U$2.24(IOL_17B) U$2.49(IOB_81_GBIN5) U$2.52(IOB_82_GBIN4) U$2.64(IOB_104_CBSEL1) U$2.73(IOR_109) U$2.74(IOR_110) U$2.75(IOR_111) U$2.76(IOR_112) U$2.77(NC) U$2.78(IOR_114) U$2.79(IOR_115) U$2.80(IOR_116) U$2.81(IOR_117) U$2.82(IOR_118) U$2.83(IOR_119) U$2.84(IOR_120) U$2.85(IOR_128) U$2.87(IOR_136) U$2.88(IOR_137) U$2.90(IOR_138) U$2.91(IOR_139) U$2.93(IOR_140_GBIN3) U$2.94(IOR_141_GBIN2) U$2.95(IOR_144) U$2.96(IOR_146) U$2.97(IOR_147) U$2.98(IOR_148) U$2.99(IOR_152) U$2.109(VPP_FAST) U$2.119(IOT_178) U$2.120(IOT_179) U$2.121(IOT_181) U$2.122(IOT_190) U$2.124(IOT_191) U$2.128(IOT_197_GBIN1) U$2.129(IOT_198_GBIN0)

### Notes on the sheet
- IO Banks
- R2R Dac
- SPI
- Clock

## Sheet 3 of 4
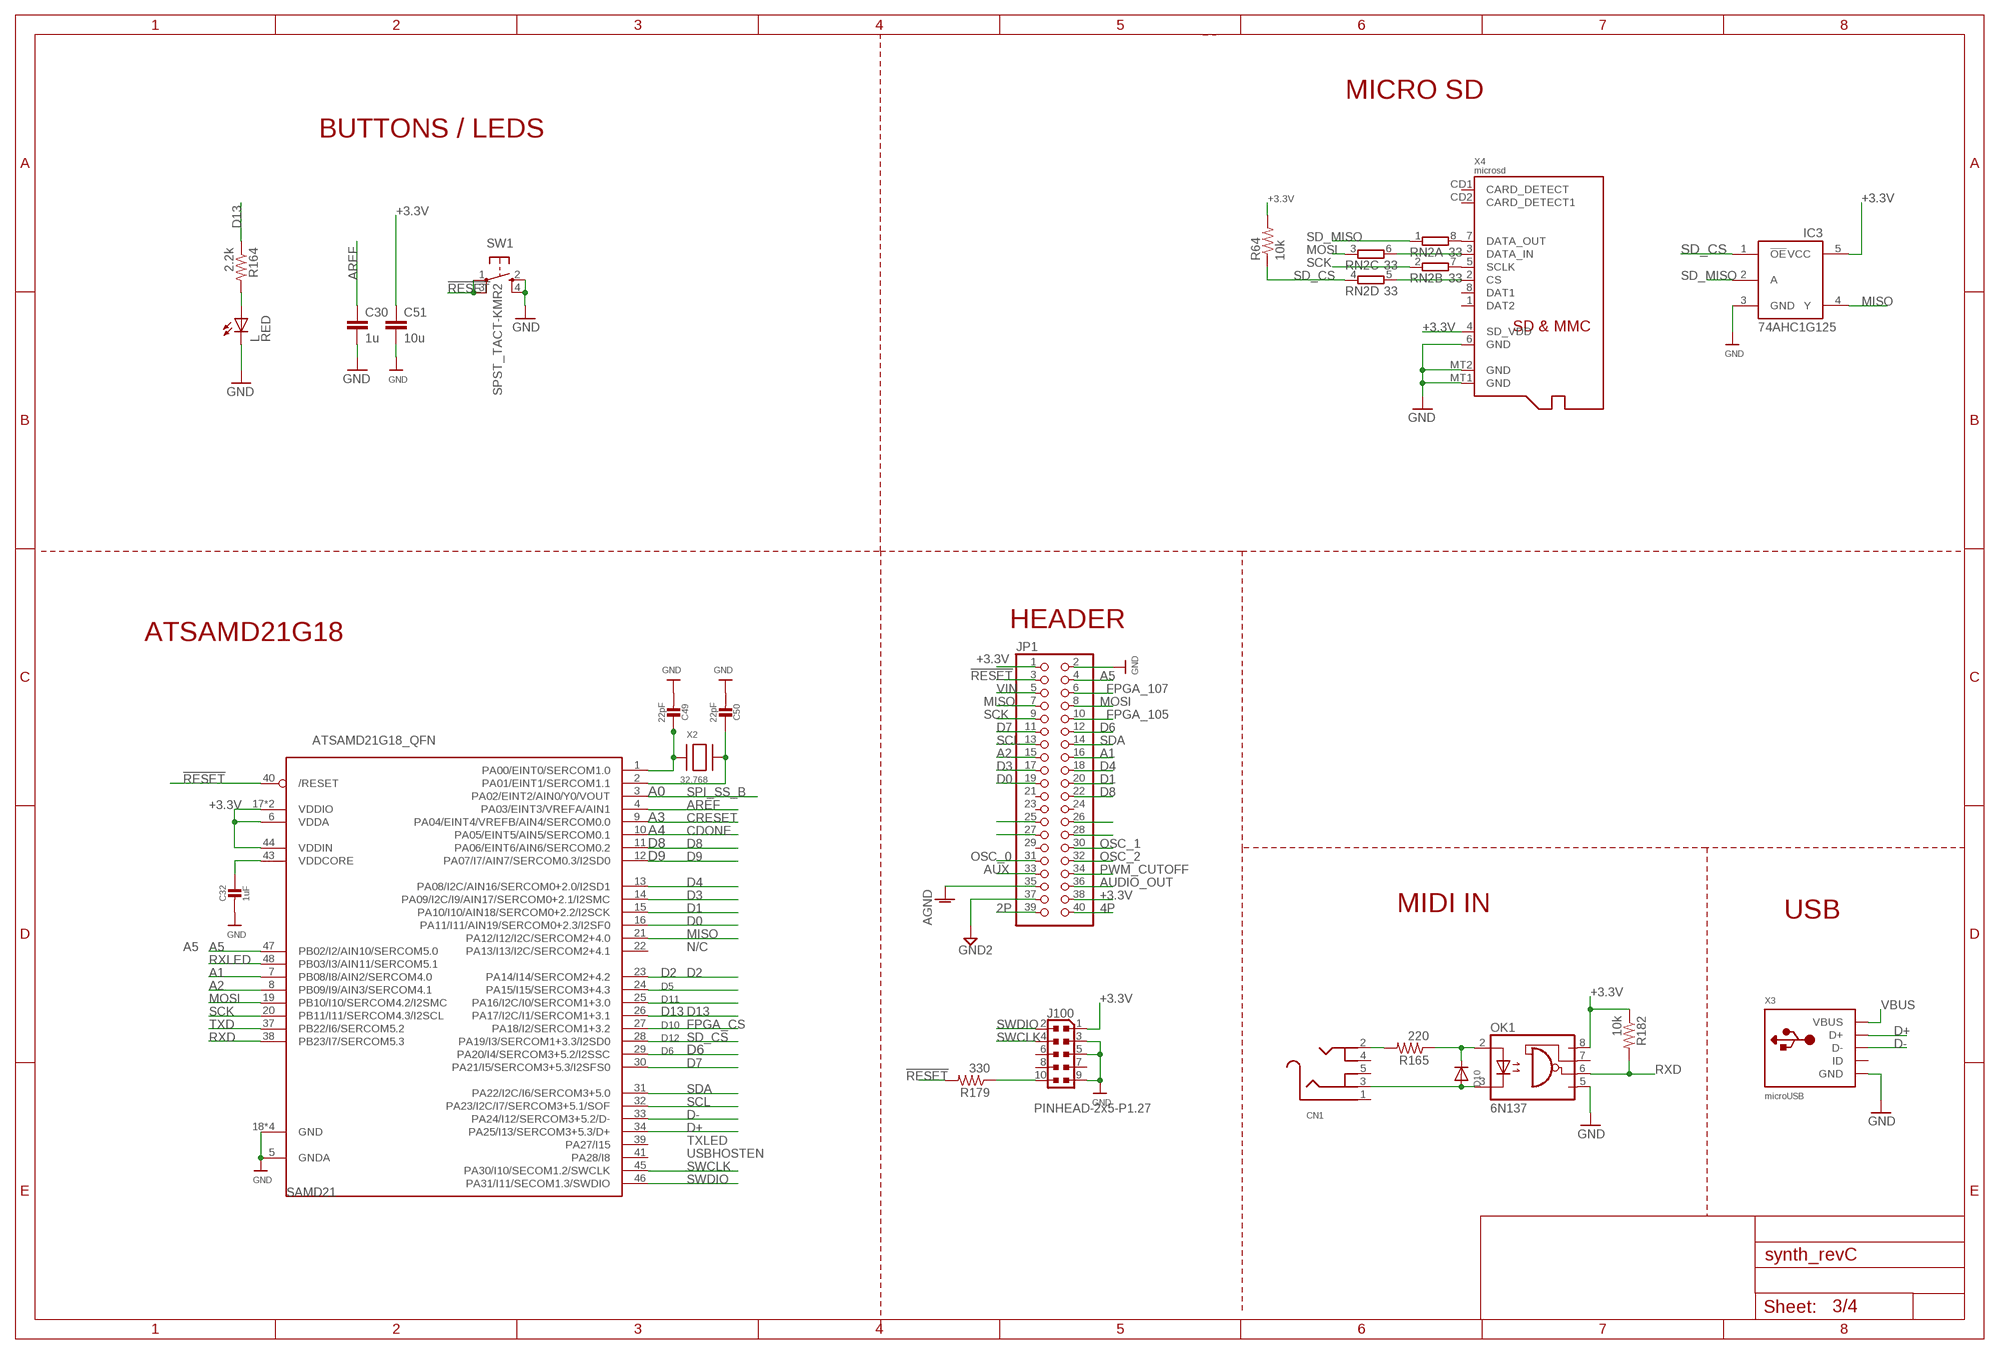
[diagram p4: schematic, sheet 3]

### Parts
C30  1u  C-EUC0603  [C0603]
C32  1uF  CAP_CERAMIC0603_NO  [0603-NO]
C49  22pF  CAP_CERAMIC0603_NO  [0603-NO]
C50  22pF  CAP_CERAMIC0603_NO  [0603-NO]
C51  10u  C-EUC0603  [C0603]
CN1  AUDIO_3.5MMJACK  [4UCONN_19269]
D10  DIODESOD-523  [SOD-523]
IC3  74AHC1G125  [SOT23-5L]
J100  PINHEAD-2x5-P1.27  0171_PH127-205DF055G00AROUND-PADS  [PINHEAD_2X05_127]
JP1  PINHD-2X20  [2X20]
L  RED  LEDCHIP-LED0805  [CHIP-LED0805]
OK1  6N137  [DIL8-SMD]
R64  10k  R-US_R0603  [R0603]
R164  2.2k  R-US_R0603  [R0603]
R165  220  R-US_R0603  [R0603]
R179  330  R-US_R0603  [R0603]
R182  10k  R-US_R0603  [R0603]
RN2  33  4R-N0603-ARC  [0603-ARC]
SAMD21  ATSAMD21G18_QFN  ATSAMD21J_QFN  [TQFN48_7MM]
SW1  SPST_TACT-KMR2  [KMR2]
X2  32.768  XTAL-3.2X1.5  [XTAL3215]
X3  microUSB  USB_MICRO_20329_V2  [4UCONN_20329_V2]
X4  microsd  MICROSD  [MICROSD]

### Nets
2P: JP1.39 ; also sheet 1
4P: JP1.40 ; also sheet 1
!RESET: JP1.3 R179.2 SAMD21.40(/RESET) SW1.1(P) SW1.3(P1)
+3.3V: C51.1 IC3.5(VCC) J100.1 JP1.1 JP1.38 OK1.8(VCC) R64.2 R182.1 SAMD21.6(VDDA) SAMD21.17(VDDIO) SAMD21.36(VDDIO) SAMD21.44(VDDIN) X4.4(SD_VDD) ; also sheet 1,2,4
A1: JP1.16 SAMD21.7(PB08/I8/AIN2/SERCOM4.0)
A2: JP1.15 SAMD21.8(PB09/I9/AIN3/SERCOM4.1)
A5: JP1.4 SAMD21.47(PB02/I2/AIN10/SERCOM5.0)
AGND: JP1.35 ; also sheet 1
AREF: C30.1 SAMD21.4(PA03/EINT3/VREFA/AIN1)
AUDIO_OUT: JP1.36 ; also sheet 1
AUX: JP1.33 ; also sheet 1
CDONE: SAMD21.10(PA05/EINT5/AIN5/SERCOM0.1) ; also sheet 2
CRESET: SAMD21.9(PA04/EINT4/VREFB/AIN4/SERCOM0.0) ; also sheet 2
D0: JP1.19 SAMD21.16(PA11/I11/AIN19/SERCOM0+2.3/I2SF0)
D1: JP1.20 SAMD21.15(PA10/I10/AIN18/SERCOM0+2.2/I2SCK)
D2: SAMD21.23(PA14/I14/SERCOM2+4.2)
D3: JP1.17 SAMD21.14(PA09/I2C/I9/AIN17/SERCOM0+2.1/I2SMC)
D4: JP1.18 SAMD21.13(PA08/I2C/AIN16/SERCOM0+2.0/I2SD1)
D6: JP1.12 SAMD21.29(PA20/I4/SERCOM3+5.2/I2SSC)
D7: JP1.11 SAMD21.30(PA21/I5/SERCOM3+5.3/I2SFS0)
D8: JP1.22 SAMD21.11(PA06/EINT6/AIN6/SERCOM0.2)
D9: SAMD21.12(PA07/I7/AIN7/SERCOM0.3/I2SD0)
D13: R164.1 SAMD21.26(PA17/I2C/I1/SERCOM1+3.1)
D+: SAMD21.34(PA25/I13/SERCOM3+5.3/D+) X3.D+
D-: SAMD21.33(PA24/I12/SERCOM3+5.2/D-) X3.D-
FPGA_105: JP1.10 ; also sheet 2
FPGA_107: JP1.6 ; also sheet 2
FPGA_CS: SAMD21.27(PA18/I2/SERCOM1+3.2) ; also sheet 2
GND: C30.2 C32.2 C49.2 C50.2 C51.2 IC3.3(GND) J100.3 J100.5 J100.9 JP1.2 L.C OK1.5(GND) SAMD21.5(GNDA) SAMD21.18(GND) SAMD21.35(GND) SAMD21.42(GND) SAMD21.THERMAL(GND) SW1.2(S) SW1.4(S1) X3.BASE@1(GND) X3.BASE@2(GND) X3.GND X3.SPRT@1(GND) X3.SPRT@2(GND) X3.SPRT@3(GND) X3.SPRT@4(GND) X4.6(GND) X4.MT1(GND) X4.MT2(GND) ; also sheet 1,2,4
GND2: JP1.37 ; also sheet 1
MISO: IC3.4(Y) JP1.7 SAMD21.21(PA12/I12/I2C/SERCOM2+4.0) ; also sheet 2
MOSI: JP1.8 RN2.3 SAMD21.19(PB10/I10/SERCOM4.2/I2SMC) ; also sheet 2
N$4: CN1.2 R165.2
N$15: J100.10 R179.1
N$17: SAMD21.24(PA15/I15/SERCOM3+4.3)
N$20: SAMD21.25(PA16/I2C/I0/SERCOM1+3.0)
N$36: RN2.8 X4.7(DATA_OUT)
N$43: RN2.7 X4.5(SCLK)
N$45: RN2.6 X4.3(DATA_IN)
N$47: RN2.5 X4.2(CS)
N$117: L.A R164.2
N$121: C49.1 SAMD21.1(PA00/EINT0/SERCOM1.0) X2.P$1
N$122: C50.1 SAMD21.2(PA01/EINT1/SERCOM1.1) X2.P$2
N$126: D10.K(C) OK1.2(A) R165.1
N$156: CN1.3 D10.A OK1.3(C)
N$162: JP1.27
N$171: JP1.25
N$211: JP1.28
N$212: JP1.26
OSC_0: JP1.31 ; also sheet 1,2
OSC_1: JP1.30 ; also sheet 1,2
OSC_2: JP1.32 ; also sheet 1,2
PWM_CUTOFF: JP1.34 ; also sheet 1,2
RXD: OK1.6(VO) R182.2 SAMD21.38(PB23/I7/SERCOM5.3)
RXLED: SAMD21.48(PB03/I3/AIN11/SERCOM5.1)
SCK: JP1.9 RN2.2 SAMD21.20(PB11/I11/SERCOM4.3/I2SCL) ; also sheet 2
SCL: JP1.13 SAMD21.32(PA23/I2C/I7/SERCOM3+5.1/SOF)
SD_CS: IC3.1(!OE) R64.1 RN2.4 SAMD21.28(PA19/I3/SERCOM1+3.3/I2SD0)
SD_MISO: IC3.2(A) RN2.1
SDA: JP1.14 SAMD21.31(PA22/I2C/I6/SERCOM3+5.0)
SPI_SS_B: SAMD21.3(PA02/EINT2/AIN0/Y0/VOUT) ; also sheet 2
SWCLK: J100.4 SAMD21.45(PA30/I10/SECOM1.2/SWCLK)
SWDIO: J100.2 SAMD21.46(PA31/I11/SECOM1.3/SWDIO)
TXD: SAMD21.37(PB22/I6/SERCOM5.2)
VBUS: X3.VBUS ; also sheet 4
VDDCORE1: C32.1 SAMD21.43(VDDCORE)
VIN: JP1.5 ; also sheet 4
Unconnected: CN1.1 CN1.4 CN1.5 J100.6 J100.7 J100.8 JP1.21 JP1.23 JP1.24 JP1.29 OK1.7(VE) SAMD21.22(PA13/I13/I2C/SERCOM2+4.1) SAMD21.39(PA27/I15) SAMD21.41(PA28/I8) X3.ID X4.1(DAT2) X4.8(DAT1) X4.CD1(CARD_DETECT) X4.CD2(CARD_DETECT1)

### Notes on the sheet
- MICRO SD
- BUTTONS / LEDS
- HEADER
- ATSAMD21G18
- A0
- A3
- A4
- D8
- D9
- MIDI IN | USB
- A5 | N/C
- RXLED
- D2
- D5
- D11
- D13
- TXD | D10
- RXD | D12
- D6
- TXLED
- USBHOSTEN

## Sheet 4 of 4
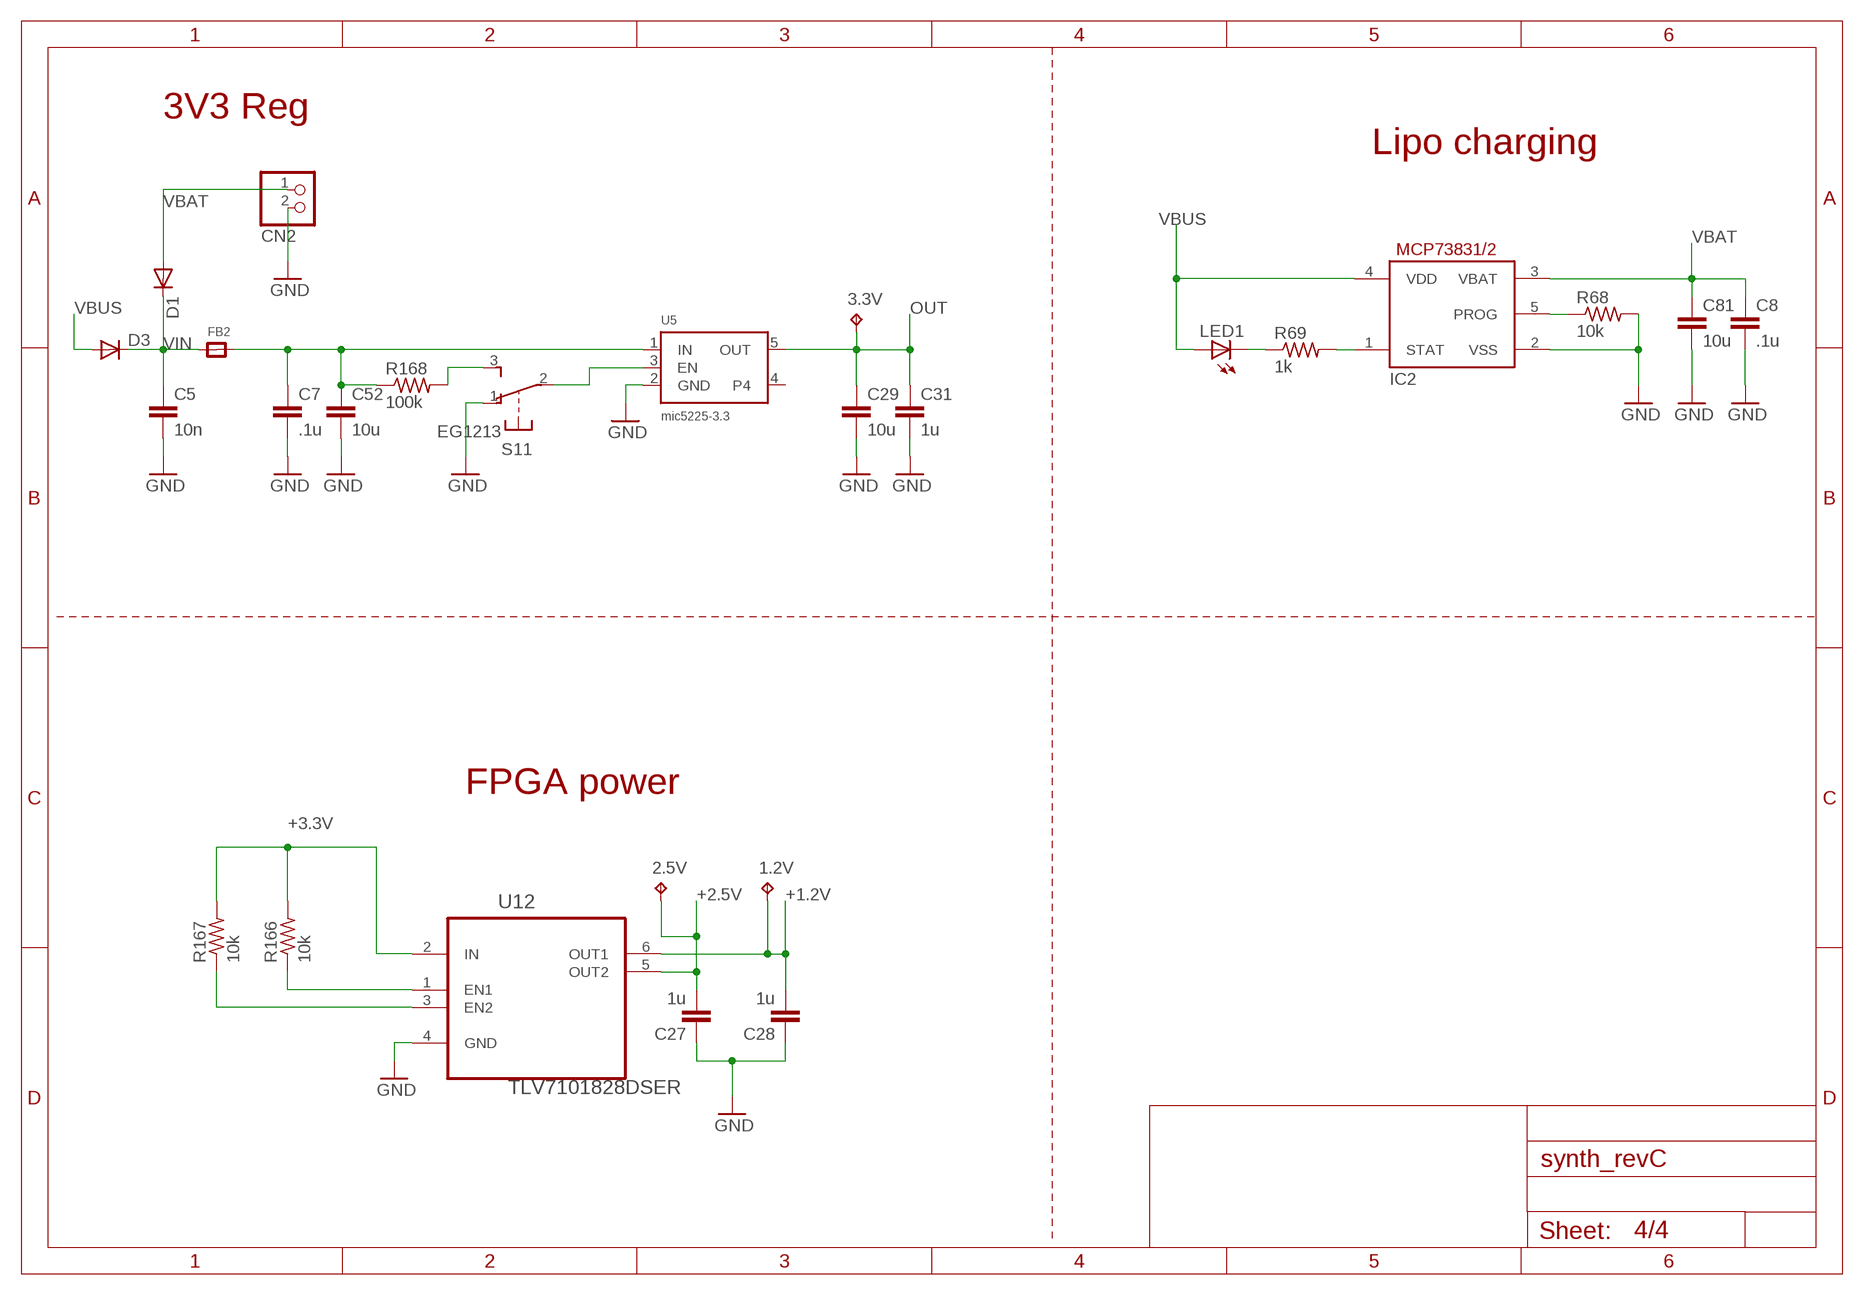
[diagram p5: schematic, sheet 4]

### Parts
1.2V  TPB1,27  [B1,27]
2.5V  TPB1,27  [B1,27]
3.3V  TPB1,27  [B1,27]
C5  10n  C-EUC0603  [C0603]
C7  .1u  C-EUC0603  [C0603]
C8  .1u  C-EUC0603  [C0603]
C27  1u  C-EUC0603  [C0603]
C28  1u  C-EUC0603  [C0603]
C29  10u  C-EUC0603  [C0603]
C31  1u  C-EUC0603  [C0603]
C52  10u  C-EUC0603  [C0603]
C81  10u  C-EUC0603  [C0603]
CN2  JST_2PIN-SMT-RA  [JST-PH-2-SMT-RA]
D1  DIODE-SOD123  [SOD123]
D3  DIODE-SOD123  [SOD123]
FB2  FERRITE  [0603]
IC2  MCP73831/OT  [SOT23-5L]
LED1  LEDCHIP-LED0805  [CHIP-LED0805]
R68  10k  R-US_R0603  [R0603]
R69  1k  R-US_R0603  [R0603]
R166  10k  R-US_R0603  [R0603]
R167  10k  R-US_R0603  [R0603]
R168  100k  R-US_R0603  [R0603]
S1  EG1213  [EG1213]
U5  mic5225-3.3  VREG_SOT23-5  [SOT23-5]
U12  TLV7101828DSER  [SON50P150X150X80-6N]

### Nets
$P9999: C7.1 C52.1 FB2.2 R168.1 U5.1(IN)
+1.2V: 1.2V.TP C28.2 U12.6(OUT1) ; also sheet 2
+2.5V: 2.5V.TP C27.2 U12.5(OUT2)
+3.3V: R166.2 R167.2 U12.2(IN) ; also sheet 1,2,3
GND: C5.2 C7.2 C8.2 C27.1 C28.1 C29.2 C31.2 C52.2 C81.2 CN2.2 IC2.2(VSS) R68.2 S1.1(1:O) U5.2(GND) U12.4(GND) ; also sheet 1,2,3
N$1: R168.2 S1.3(1:S)
N$12: IC2.5(PROG) R68.1
N$16: S1.2(1:P) U5.3(EN)
N$27: IC2.1(STAT) R69.2
N$53: LED1.C R69.1
N$118: R166.1 U12.1(EN1)
N$119: R167.1 U12.3(EN2)
OUT: 3.3V.TP C29.1 C31.1 U5.5(OUT)
VBAT: C8.1 C81.1 CN2.1 D1.A IC2.3(VBAT)
VBUS: D3.A IC2.4(VDD) LED1.A ; also sheet 3
VIN: C5.1 D1.C D3.C FB2.1 ; also sheet 3
Unconnected: S1.MT1(MT) S1.MT2(MT) U5.4

### Notes on the sheet
- 3V3 Reg
- Lipo charging
- FPGA power

## Library data of the parts
1.2V 2.5V 3.3V CLK OSC0 OSC1 OSC2 = testpad:TP: Test pad
C1-C5 C7-C31 C33-C48 C51-C82 C88 C89 = rcl:C-EU: CAPACITOR, European symbol
C6 = rcl:CPOL-US: POLARIZED CAPACITOR, American symbol
C32 C49 C50 = microbuilder:CAP_CERAMIC: Ceramic Capacitors For new designs, use the packages preceded by an '_' character since they are more reliable: The following footprints should be used on most boards: _0402 - Standard footprint for regular board layouts _0603 - Standard footprint for regular board layouts _0805 - Standard footprint for regular board layouts _1206 - Standard footprint for regular board layouts For extremely tight-pitch boards where space is at a premium, the following 'micro-pitch' footprints can be used (smaller pads, no silkscreen outline, etc.): _0402MP - Micro-pitch footprint for very dense/compact boards _0603MP - Micro-pitch footprint for very dense/compact boards _0805MP - Micro-pitch footprint for very dense/compact boards _1206MP - Micro-pitch footprint for very dense/compact boards
CN1 CN3 = microbuilder:AUDIO_3.5MMJACK: 3.5MM Audio Jack These are normally connected as follows, from left-to right on the schematic symbol above: Tip: Left Audio Inner Ring: Right Audio Shell: Common/GND
CN2 = adafruit:JST_2PIN: JST 2-Pin Connectors of various flavors SMT-RA (S2B-PH-SM4) 4UConnector #17311 SMT (B2B-PH-SM4) THM-RA (S2B-PH) THM (B2B-PH)
D1 D3 = diode:DIODE-: DIODE
D2 D10 = adafruit:DIODE: Diode SMADIODE - SMA Surface Mount Package 20V 1A Schottky Diode Digikey: 641-1014-6-ND DO-1N4148 - Through Hole Small Current Diode SOD-123 20V 1 A (.5mV Vf) Schottky Diode - Digikey: MBRX120TPMSCT-ND SOD-323 10V 570mA (.38mV Vf, 3ns) Schottky Diode - Digikey: ZLLS410CT-ND SOD-523 30V 30mA Schottky Diode (RB751S-40TE61) - Digikey: RB751S-40TE61CT-ND SOT23-R/W - SOT23 Package (R = Solder Paste/Reflow Ovens, W = Hand-Soldering) BAT54Film 40V 300mA - Digikey: 497-7162-1-ND
FB1-FB3 = microbuilder:FERRITE: Ferrite Bead 0603 MMZ1608B121C - 120 Ohm @ 100MHz, 600mA, 0.15 Ohm DC Resistance - Digikey: 445-2164-1-ND BK1608HW121-T - 120 Ohm, 600mA Ferrite Chip - Digikey: 587-1876-2-ND 0805 HZ0805B272R-10 - 2.7K Ohm @ 100MHz, 200mA, 0.8 Ohm DC Resistance - Digikey: 240-2504-1-ND (see also Murata BLM21BD272SN1L) MMZ2012Y152B - 1.5K Ohm @ 100MHz, 500mA, 0.4 Ohm DC Resistance - Digikey: 445-1560-1-ND - Mainly for high frequency (80-400MHz) MMZ2012R102A - 1K Ohm @ 100MHz, 500mA, 0.3 Ohm DC Resistance - Digikey: 445-1555-2-ND - More general purpose (10-200MHz)
IC1 IC3 IC4 = adafruit:74AHC1G125
IC2 = adafruit:MCP73831: MCP73831/2 Miniature Single-Cell, Fully Integrated Li-Ion, Li-Polymer Charge Management Controllers. Nice and small simple lipoly charge controller, with adjustable current and status output (LED) http://www.ladyada.net/library/pcb/eaglelibrary.html
J100 = Connettori:0171_PH127-205DF055G00A: 2x5 PASSO 1,27
JP1 = adafruit:PINHD-2X20: PIN HEADER
L LED1 = adafruit:LED: LED OSRAM: - CHIPLED LG R971, LG N971, LY N971, LG Q971, LY Q971, LO R971, LY R971 LH N974, LH R974 LS Q976, LO Q976, LY Q976 LO Q996 - Hyper CHIPLED LW Q18S LB Q993, LB Q99A, LB R99A - SideLED LS A670, LO A670, LY A670, LG A670, LP A670 LB A673, LV A673, LT A673, LW A673 LH A674 LY A675 LS A676, LA A676, LO A676, LY A676, LW A676 LS A679, LY A679, LG A679 - Hyper Micro SIDELED® LS Y876, LA Y876, LO Y876, LY Y876 LT Y87S - SmartLED LW L88C, LW L88S LB L89C, LB L89S, LG L890 LS L89K, LO L89K, LY L89K LS L896, LA L896, LO L896, LY L896 - TOPLED LS T670, LO T670, LY T670, LG T670, LP T670 LSG T670, LSP T670, LSY T670, LOP T670, LYG T670 LG T671, LOG T671, LSG T671 LB T673, LV T673, LT T673, LW T673 LH T674 LS T676, LA T676, LO T676, LY T676, LB T676, LH T676, LSB T676, LW T676 LB T67C, LV T67C, LT T67C, LS T67K, LO T67K, LY T67K, LW E67C LS E67B, LA E67B, LO E67B, LY E67B, LB E67C, LV E67C, LT E67C LW T67C LS T679, LY T679, LG T679 LS T770, LO T770, LY T770, LG T770, LP T770 LB T773, LV T773, LT T773, LW T773 LH T774 LS E675, LA E675, LY E675, LS T675 LS T776, LA T776, LO T776, LY T776, LB T776 LHGB T686 LT T68C, LB T68C - Hyper Mini TOPLED® LB M676 - Mini TOPLED Santana® LG M470 LS M47K, LO M47K, LY M47K Source: http://www.osram.convergy.de/
OK1 = deanParts:6N137: MOTOROLA OPTO COUPLER
R1-R63 R65-R67 R70-R75 R99 R169-R178 R180 R181 R184-R192 R194 = rcl:R-US_: RESISTOR, American symbol
R64 R68 R69 R164-R168 R179 R182 R183 = adafruit:R-US_: RESISTOR, American symbol
RAM1 = deanParts:N25Q032A13ESC40FTR: Micron Serial NOR Flash Memory 3V, Multiple I/O, 4KB Sector Erase N25Q032A
RN2-RN5 = resistor-dil:4R-N: Array Chip Resistor Source: RS Component / Phycomp; OC_FARNELL: unknown; OC_NEWARK: unknown
RN6-RN17 = resistor-array:742-16_S: CTS 742 Series 16 Terminations, 8 Resistors
S1 = adafruit:EG1213: E-Switch right-angle slide SPDT Part #EG1213 http://www.ladyada.net/library/eagle
SAMD21 = microbuilder:ATSAMD21J
SW1 = adafruit:SPST_TACT: SMT 6mm switch, EVQQ2 series http://www.ladyada.net/library/eagle
U1 U4 U8 U9 U14 U15 U18 = deanParts:TLV274IPWR: OPERATIONAL AMPLIFIERS; MPN: TLV274IPWR; OC_FARNELL: -; OC_NEWARK: 76C8503; PACKAGE: SOIC-14; SUPPLIER: Texas Instruments
U2 U3 U6 U7 U10 U11 U16 U17 U21 U22 U24 U25 U27 U28 U30 U31 = deanParts:DMMT3906W-7-F: MATCHED PNP SMALL SIGNAL SURFACE MOUNT TRANSISTOR; MPN: DMMT3906W-7-F; OC_FARNELL: 1773643; OC_NEWARK: 51R6457; PACKAGE: SOT-323-6; SUPPLIER: Diodes Inc
U5 = microbuilder:VREG_SOT23-5: SOT23-5 Fixed Voltage Regulators Part Current Out V Out V In V Dropout θJA (°C/W) TJ (°C) Digikey Part No. ADP121 150mA 3.3V 3.4-5.5V 0.09V @ 150mA -- -- ADP121-AUJZ33R7CT-ND ADP121 150mA 3.0V 3.1-5.5V 0.09V @ 150mA -- -- ADP121-AUJZ30R7CT-ND ADP122 300mA 3.3V 3.4-5.5V 0.085V @ 300mA -- -- ADP122AUJZ-3.3-R7CT-ND ADP1712 300mA 3.3V 3.5-5.5V 0.17V @ 300mA -- -- ADP1712AUJZ-3.3-R7TR-ND AP7311 (Low Cost) 150mA 3.3V 3.5-6V 0.15V @ 150mA -- -- AP7311-33WG-7DICT-ND LD39015M18R 150mA 1.8V 1.9V-5.5V 0.08V @ 100mA -- -- 497-6977-1-ND LP2985A-33DBVR 150mA 3.3V 3.3-16V 0.28V @ 150mA 206 150 296-18479-1-ND MCP1824T-3302E/OT 300mA 3.3V 3.5V-6V 0.2V @ 300mA -- -- MCP1824T-3302E/OTCT-ND MIC5205-2.5YM5 TR 150mA 2.5V 2.7-16V 0.165V @ 150mA -- -- 576-1257-2-ND MIC5205-3.0YM5 TR 150mA 3.0V 3.2V-16V 0.165V @ 150mA -- -- 576-1258-2-ND MIC5205-3.3YM5 TR 150mA 3.3V 3.5V-16V 0.165V @ 150mA -- -- 576-1259-2-ND TPS780330220 150mA 3.3V+2.2V 3.6-5.5V 250mV Max -- -- 296-23332-1-ND TDA3663/N1,135 100mA 3.3V 3.5-45V 0.18V @ 50mA -- -- 568-5343-1-ND Max operating temp can be calculated using θJA, TJ (max junction temperature), and power in watts. Set the "Maximum Ambient Temperature" until it reaches TJ ("Max Junction Temperature"), which is the absolute limit for safe use of the regulator: Heat Sink Temperature Calculator <http://www.daycounter.com/Calculators/Heat-Sink-Temperature-Calculator.phtml> For example, With 12V source into a 3.3V LP2985 and a 30mA load, we are dissipating (12V-3.3V) * 0.03A = 0.261W. With a θJA of 206 °C/W, a TJ of 150°C, and 261mW we can safely use the chip without a heat sink up to 75°C (=147.1°C Junction Temperature).
U12 = Texas Instruments_By_element14_Batch_1:TLV7101828DSER: Low-Dropout Regulator; MPN: TLV7101828DSER; OC_FARNELL: -; OC_NEWARK: 01T0734; PACKAGE: SON-6; SUPPLIER: Texas Instruments
U13 = deanParts:TLV2471IDBVT: FAMILY OF 600ìA/Ch 2.8MHz RAIL-TO-RAIL INPUT/OUTPUT HIGH-DRIVE OPERATIONAL AMPLIFIERS WITH SHUTDOWN; MPN: TLV2471IDBVT; OC_FARNELL: 1102964; OC_NEWARK: 24M8315; PACKAGE: SOT-23-5; SUPPLIER: Texas Instruments
U$1 U$3 U$4 U$7-U$9 U$15 U$16 = deanParts:DMMT3904W-7-F: Matched NPN transistor pair
U$2 = deanParts:ICE40HX4K: Lattice ICE40HX4k fpga in TQ-144 package
U$5 = deanParts:SIT1602: MEMS oscillator
U$19 = deanParts:LM4819MMX: 350mW Audio Power Amp
X2 = adafruit2:XTAL: Low cost SMT crystals, no capacitors included http://www.ladyada.net/library/eagle
X3 = microbuilder:USB: USB Connectors USBMINIB - Surface Mount Female Mini-B USB Connector 4UConnector: 06564
X4 = microbuilder:MICROSD: MicroSD/Transflash Card Holder with SPI pinout 3M: 2908-05WB-MG 4UConnector: 19656 Footprint courtesy: Adafruit Industries

## Net classes
3 usbvcc: width 0.102 mm, drill 0.1 mm, clearance 0.15 mm